# Altium project Alife7-genx320-version-ctrl-rev3.PrjPcb
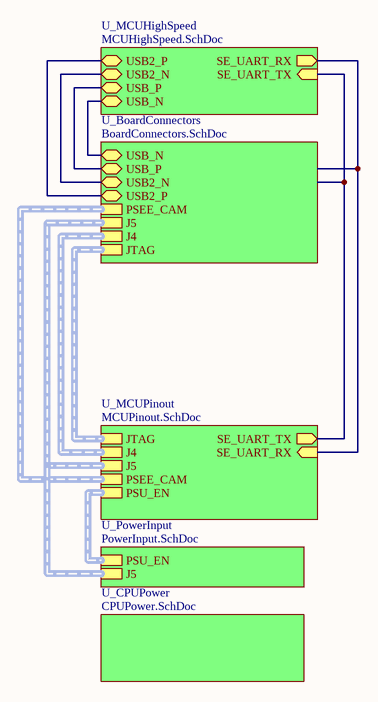
[diagram p0: TopLevel.SchDoc]
CAGE_CODE: ?????; CONTRACT_NUMBER: <CONTRACT NO>; DOC_NO_ASSY_DWG: <ASSY DWG NO>; DOC_NO_BOM: <BOM DOC NO>; DOC_NO_FAB_DWG: <FAB DWG NO>; DOC_NO_SCH_DWG: <SCH DWG NO>; PCB_2_DEC_TOL: +/-.01; PCB_3_DEC_TOL: +/-.010; PCB_ANG_TOL: +/-1/2; PCB_ASSEMBLY_NO: <PCB ASSY NO>; PCB_CHECKER: - -----; PCB_CHECKER_APP_DATE: --/--/----; PCB_DESIGNER: - -----; PCB_DESIGNER_APP_DATE: --/--/----; PCB_DWG_NO: <PCB DWG NO>; PCB_ENGINEER: - -----; PCB_ENGINEER_APP_DATE: --/--/----; PCB_PART_NUMBER: <PCB PN>; PCB_REV: A; SCH_REV: A
6 sheets, 115 parts. Net scope: hierarchical (ports join the sheet entries above them; power ports are global).
Board file: PCB_Rev3.PcbDoc
Sheets:
  TopLevel.SchDoc
    U_CPUPower = CPUPower.SchDoc
    U_PowerInput = PowerInput.SchDoc
    U_BoardConnectors = BoardConnectors.SchDoc
    U_MCUHighSpeed = MCUHighSpeed.SchDoc
    U_MCUPinout = MCUPinout.SchDoc

## Sheet TopLevel.SchDoc
size A; SheetNumber: 1; SheetTotal: 6

### Sub-sheets
U_BoardConnectors = BoardConnectors.SchDoc: USB_N (bidir), USB_P (bidir), PSEE_CAM (harness Camera harness), J5 (harness Header J5), J4 (harness Header J4), JTAG (harness JTAG), USB2_N (bidir), USB2_P (bidir)
U_CPUPower = CPUPower.SchDoc: no entries
U_MCUHighSpeed = MCUHighSpeed.SchDoc: USB_P (bidir), USB_N (bidir), USB2_P (bidir), USB2_N (bidir), SE_UART_TX (in), SE_UART_RX (out)
U_MCUPinout = MCUPinout.SchDoc: JTAG (harness JTAG), J4 (harness Header J4), J5 (harness Header J5), SE_UART_RX (in), SE_UART_TX (out), PSEE_CAM (harness Camera harness), PSU_EN (harness Power supply enable)
U_PowerInput = PowerInput.SchDoc: PSU_EN (harness Power supply enable), J5 (harness Power supply enable)

### Nets
SEUART_RX: sheet U_MCUHighSpeed/SE_UART_RX, sheet U_MCUPinout/SE_UART_RX
SEUART_TX: sheet U_MCUHighSpeed/SE_UART_TX, sheet U_MCUPinout/SE_UART_TX
USB2_N: sheet U_BoardConnectors/USB2_N, sheet U_MCUHighSpeed/USB2_N
USB2_P: sheet U_BoardConnectors/USB2_P, sheet U_MCUHighSpeed/USB2_P
USB_N: sheet U_BoardConnectors/USB_N, sheet U_MCUHighSpeed/USB_N
USB_P: sheet U_BoardConnectors/USB_P, sheet U_MCUHighSpeed/USB_P

### Buses and harness runs
harness sheet U_BoardConnectors/J4 = sheet U_MCUPinout/J4
harness sheet U_BoardConnectors/J5 = sheet U_MCUPinout/J5 = sheet U_PowerInput/J5
harness sheet U_BoardConnectors/JTAG = sheet U_MCUPinout/JTAG
harness sheet U_BoardConnectors/PSEE_CAM = sheet U_MCUPinout/PSEE_CAM
harness sheet U_MCUPinout/PSU_EN = sheet U_PowerInput/PSU_EN

## Sheet CPUPower.SchDoc
size 393 x 279 mm; DrawnBy: Gustav Eckerbom; SheetNumber: 3; SheetTotal: 6; Project revision: Rev 1; Sheet name: CPU Power; Sheet size: A3; Project: alife7-genx320cam
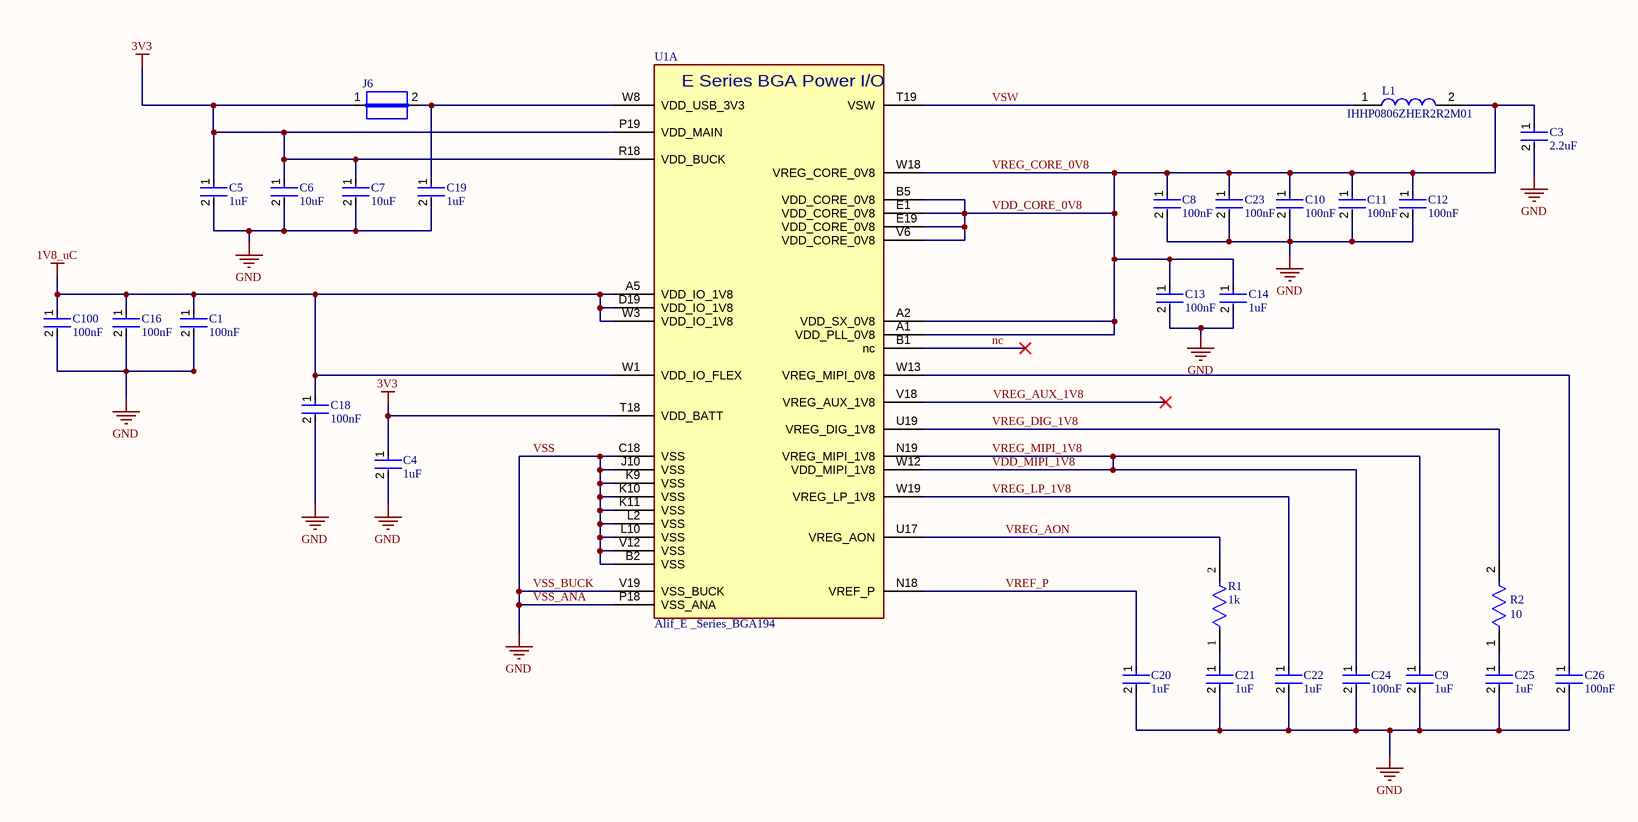
[diagram p1: CPUPower.SchDoc]

### Parts
C1  100nF  [FP-C0603X104K3RACTU-MFG]
C3  2.2uF  [FP-CC0603-DA-MFG]
C4  1uF  [FP-CL10-IPC_C]
C5  1uF  [FP-CL10-IPC_C]
C6  10uF  [FP-CC0603-0_15-0_95-IPC_C]
C7  10uF  [FP-CC0603-0_15-0_95-IPC_C]
C8  100nF  [FP-C0603X104K3RACTU-MFG]
C9  1uF  [FP-CL10-IPC_C]
C10  100nF  [FP-C0603X104K3RACTU-MFG]
C11  100nF  [FP-C0603X104K3RACTU-MFG]
C12  100nF  [FP-C0603X104K3RACTU-MFG]
C13  100nF  [FP-C0603X104K3RACTU-MFG]
C14  1uF  [FP-CL10-IPC_C]
C16  100nF  [FP-C0603X104K3RACTU-MFG]
C18  100nF  [FP-C0603X104K3RACTU-MFG]
C19  1uF  [FP-CL10-IPC_C]
C20  1uF  [FP-CL10-IPC_C]
C21  1uF  [FP-CL10-IPC_C]
C22  1uF  [FP-CL10-IPC_C]
C23  100nF  [FP-C0603X104K3RACTU-MFG]
C24  100nF  [FP-C0603X104K3RACTU-MFG]
C25  1uF  [FP-CL10-IPC_C]
C26  100nF  [FP-C0603X104K3RACTU-MFG]
C100  100nF  [FP-C0603X104K3RACTU-MFG]
J6  JUMPER  [JUMPER]  (value not drawn)
L1  IHHP0806ZHER2R2M01  [INDC2016X80N]
R1  1k  [FP-RCA0603-e3-MFG]
R2  10  [FP-RT0603-MFG]
U1  Alif_E _Series_BGA194  [BGA194 _CENTERED]  (part A of 4)

### Nets
1V8_uC: C1.1 C16.1 C18.1 C100.1 U1.A5(VDD_IO_1V8) U1.D19(VDD_IO_1V8) U1.W1(VDD_IO_FLEX) U1.W3(VDD_IO_1V8)
3V3: C4.1 C5.1 C6.1 C7.1 J6.1 U1.P19(VDD_MAIN) U1.R18(VDD_BUCK) U1.T18(VDD_BATT)
GND: C1.2 C3.2 C4.2 C5.2 C6.2 C7.2 C8.2 C9.2 C10.2 C11.2 C12.2 C13.2 C14.2 C16.2 C18.2 C19.2 C20.2 C21.2 C22.2 C23.2 C24.2 C25.2 C26.2 C100.2 U1.B2(VSS) U1.C18(VSS) U1.J10(VSS) U1.K9(VSS) U1.K10(VSS) U1.K11(VSS) U1.L2(VSS) U1.L10(VSS) U1.P18(VSS_ANA) U1.V12(VSS) U1.V19(VSS_BUCK)  [also labelled VSS, VSS_ANA, VSS_BUCK]
nc: U1.B1(nc)
VDD_CORE_0V8: C3.1 C8.1 C10.1 C11.1 C12.1 C13.1 C14.1 C23.1 L1.2 U1.A1(VDD_PLL_0V8) U1.A2(VDD_SX_0V8) U1.B5(VDD_CORE_0V8) U1.E1(VDD_CORE_0V8) U1.E19(VDD_CORE_0V8) U1.V6(VDD_CORE_0V8) U1.W18(VREG_CORE_0V8)  [also labelled VREG_CORE_0V8]
VDD_MIPI_1V8: C9.1 C24.1 U1.N19(VREG_MIPI_1V8) U1.W12(VDD_MIPI_1V8)  [also labelled VREG_MIPI_1V8]
VREF_P: C20.1 U1.N18(VREF_P)
VREG_AON: R1.2 U1.U17(VREG_AON)
VREG_AUX_1V8: U1.V18(VREG_AUX_1V8)
VREG_DIG_1V8: R2.2 U1.U19(VREG_DIG_1V8)
VREG_LP_1V8: C22.1 U1.W19(VREG_LP_1V8)
VSW: L1.1 U1.T19(VSW)
NetC19_1: C19.1 J6.2 U1.W8(VDD_USB_3V3)
NetC21_1: C21.1 R1.1
NetC25_1: C25.1 R2.1
NetC26_1: C26.1 U1.W13(VREG_MIPI_0V8)

### Notes on the sheet
- Project:
- Sheet Name
- Project revision:
- Drawn by:
- Sheet size
- SHEET
- OF
- (in symbol E7_B0_194BGA, part A) E Series BGA Power I/O

### Library data of the parts
C1 C8 C10-C13 C16 C18 C23 C24 C26 C100 = CMP-2006-00002-2: CAP CER 0.1UF 25V X7R 0603; Dielectric Material: Ceramic; Tolerance: 10%; Dissipation Factor: 3.5%; Features: Soft Termination; Construction: Flat; Number of Pins: 2; Depth: 0.8mm; Case Code (Metric): 1608; Termination: SMD/SMT; REACH SVHC: No SVHC; Dielectric: X7R; Thickness: 0.034inch; Series: C0603X; Case Code (Imperial): 0603; Voltage: 25V; Radiation Hardening: No; Length: 1.6mm; RoHS Compliant: Yes; Case/Package: 0603; Voltage Rating (DC): 25V; Max Operating Temperature: 125°C; Package Quantity: 1; Packaging: Tape and Reel; Width: 0.8mm; Height: 0.8mm; Capacitance: 100nF; Mount: Surface Mount; Voltage Rating: 25V; Contact Plating: Tin; Min Operating Temperature: -55°C
C3 = CMP-03422-000262-1: CAP CER 2.2UF 6.3V X5R 0603; Manufacturer: YAGEO; Manufacturer Part Number: CC0603KRX5R5BB225; Tolerance: 0.1; Temperature Coefficient: 15%; Material: Ceramic; Automotive: No; Temperature: -55°C to +125°C; Device Class L3: Ceramic Capacitors; Voltage Rating: 6.3 V; Device Class L1: Passive Components; Height: 0.9mm; Device Class L2: Capacitors; Temperature Range High: +125°C; Temperature Range Low: -55°C; Footprint Url: http://www.yageo.com/exep/pages/download/literatures/UPY-C_GEN_24.pdf; RoHS: TRUE; Voltage: 6.3 V; Digikey Description: CAP CER 2.2UF 6.3V X5R 0603; Package: CC0603-DA; ComponentLink2Description: Datasheet; Category: Cap; Temperature Characteristic: X5R; Capacitance: 2.2 uF; Value: 2.2 uF; Lead Free: Yes; ComponentLink2URL: http://www.yageo.com/documents/recent/UPY-GPHC_X7R_6.3V-to-50V_18.pdf; Octopart: https://octopart.com/cc0603krx5r5bb225-yageo-42244630; Mouser Description: Multilayer Ceramic Capacitors MLCC - SMD/SMT 2.2uF 6.3V X5R 10%
C4 C5 C9 C14 C19-C22 C25 = CMP-001-00087-5: Ceramic Capacitor, Multilayer, Ceramic, 10V, 10% +Tol, 10% -Tol, X5R, 15% TC, 1uF, Surface Mount, 0603; Value: 1µF; Min Operating Temperature: -55°C; Max Operating Temperature: 85°C; Case/Package: 0603; Capacitor Type: Ceramic; Mounting Technology: Surface Mount; Pins: 2; RoHS Compliant: Yes
C6 C7 = CMP-001-00088-4: Ceramic Capacitor, Multilayer, Ceramic, 6.3V, 10% +Tol, 10% -Tol, X5R, 15% TC, 10uF, Surface Mount, 0603; Value: 10µF; Min Operating Temperature: -55°C; Max Operating Temperature: 85°C; Case/Package: 0603; RoHS Compliant: Yes; Capacitor Type: Ceramic; Mounting Technology: Surface Mount; Pins: 2
J6 = CMP-009-00061-2: Pins: 2
L1 = IHHP0806ZHER2R2M01: Inductor; Manufacturer_Name: Vishay; Datasheet Link: https://www.vishay.com/docs/34591/ihhp-0806zh-01.pdf; Height: 0.8mm; Manufacturer_Part_Number: IHHP0806ZHER2R2M01; Mouser Part Number: 70-IHHP0806ZHR2R2M01; Mouser Price/Stock: https://www.mouser.co.uk/ProductDetail/Vishay-Dale/IHHP0806ZHER2R2M01?qs=tlsG%2FOw5FFirx3sf52FHuA%3D%3D
R1 = CMP-00030-22249381-1: RCA06031K00FKEA SMD Chip Resistor, 1 kOhm, ± 1%, 100 mW, 0603 [1608 Metric], Thick Film, Anti-Sulfur; Max Power Dissipation: 100mW; Temperature Coefficient: 100ppm/°C; Voltage Rating (DC): 75V; Resistance: 1kΩ; Number of Terminations: 2; Packaging: Cut Tape; Features: Anti-Sulfur, Automotive AEC-Q200; RoHS: Compliant; Power Rating: 100mW; Composition: Thick Film; Radiation Hardening: No; Voltage Rating: 75V; REACH SVHC: No SVHC; Schedule B: 8533210045; Depth: 850µm; Military Standard: Not; Case Code (Metric): 1608; Contact Plating: Tin; Tolerance: 1%; NexarPartId: 22249381; Max Operating Temperature: 155°C; Mount: Surface Mount; Length: 1.55mm; Case Code (Imperial): 0603; Width: 838.2µm; Min Operating Temperature: -55°C; Case/Package: 0603; Height: 508µm
R2 = CMP-03412-033408-1: RES SMD 10 OHM 1% 1/10W 0603; Manufacturer Part Number: RT0603FRE0710RL; Manufacturer: Yageo; Voltage Rating: 75V; Power Rating: 0.1W; Temperature Coefficient: 50 ppm/°C; Resistance: 10Ω; Tolerance: 0.01; Value: 10Ω; Footprint Url: http://www.yageo.com/exep/pages/download/literatures/PYu-R_Mount_10.pdf; Ipc Land Pattern Name: RESC16080X45; RoHS: TRUE; Device Class L2: Resistors; Device Class L3: Chip SMD Resistors; Category: Res; Device Class L1: Passive Components; ComponentLink2URL: http://www.yageo.com/documents/recent/PYu-RT_1-to-0.01_RoHS_L_9.pdf; Temperature Range Low: -55°C; Height: 0.55mm; Digikey Description: RES SMD 10 OHM 1% 1/10W 0603; Temperature Range High: +155°C; Lead Free: Yes; Composition: Thin Film; Mouser Description: Thin Film Resistors - SMD 1/10W 10 ohm 1% 50ppm; Automotive: No; Package: RT0603; Temperature: -55°C to +155°C; Series: RT; ComponentLink2Description: Datasheet; Octopart: https://octopart.com/rt0603fre0710rl-yageo-39827693
U1 = E7_B0_194BGA: IC,Alif E7 MCU, Rev B silicon,BGA194; Manufacturer 1: Alif Semi; Manufacturer Part Number 1: AE722F80F55D5LS

## Sheet PowerInput.SchDoc
size 393 x 279 mm; DrawnBy: Gustav Eckerbom; SheetNumber: 6; SheetTotal: 6; Project: alife7-genx320cam; Sheet Name: PowerInput; Sheet Size: A3; Project revision: Rev 1
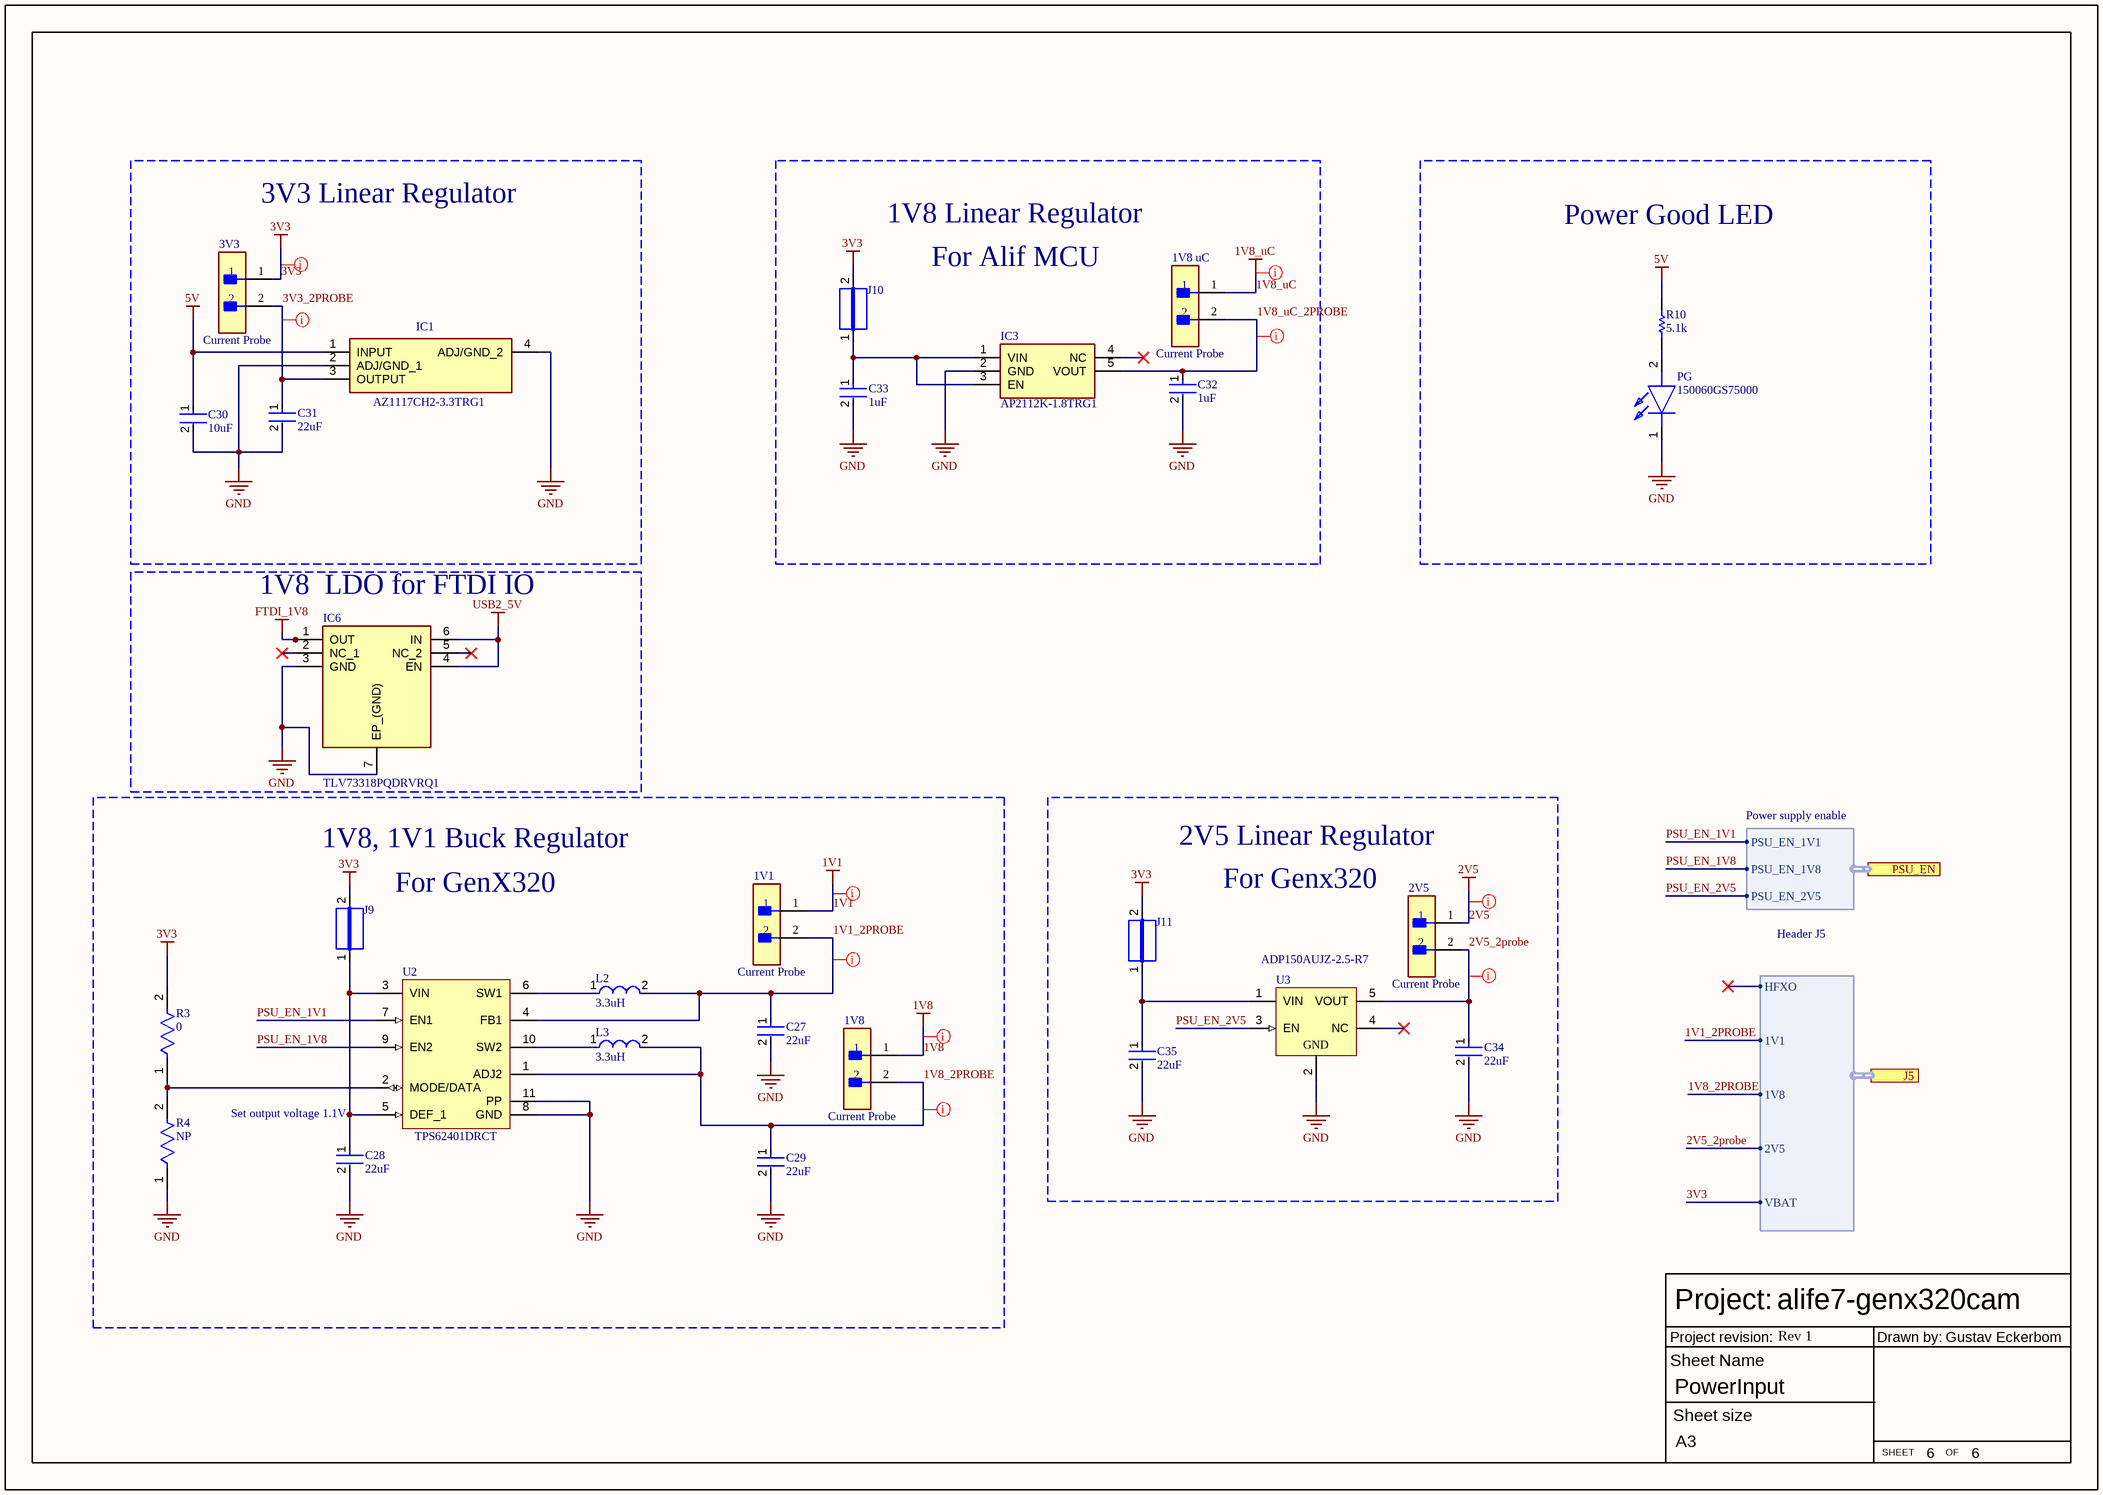
[diagram p2: PowerInput.SchDoc]

### Parts
1V1  Current Probe  [FP-4-103185-0-02-MFG]
1V8  Current Probe  [FP-4-103185-0-02-MFG]
1V8_uC  Current Probe  [FP-4-103185-0-02-MFG]
2V5  Current Probe  [FP-4-103185-0-02-MFG]
3V3  Current Probe  [FP-4-103185-0-02-MFG]
C27  22uF  [FP-1206-L_3_2_0_2-W_1_6_0-IPC_C]
C28  22uF  [FP-1206-L_3_2_0_2-W_1_6_0-IPC_C]
C29  22uF  [FP-1206-L_3_2_0_2-W_1_6_0-IPC_C]
C30  10uF  [FP-CC0603-0_15-0_95-IPC_C]
C31  22uF  [FP-1206-L_3_2_0_2-W_1_6_0-IPC_C]
C32  1uF  [FP-CL10-IPC_C]
C33  1uF  [FP-CL10-IPC_C]
C34  22uF  [FP-1206-L_3_2_0_2-W_1_6_0-IPC_C]
C35  22uF  [FP-1206-L_3_2_0_2-W_1_6_0-IPC_C]
IC1  AZ1117CH2-3.3TRG1  [SOT230P700X180-4N]
IC3  AP2112K-1.8TRG1  [SOT95P285X140-5N]
IC6  TLV73318PQDRVRQ1  [SON65P200X200X80-7N]
J9  JUMPER  [JUMPER]  (value not drawn)
J10  JUMPER  [JUMPER]  (value not drawn)
J11  JUMPER  [JUMPER]  (value not drawn)
L2  3.3uH  [FP-LQM21PH_G0-IPC_C]
L3  3.3uH  [FP-LQM21PH_G0-IPC_C]
PG  150060GS75000  [LEDC1608X80N]
R3  0  [FP-RK73Z2A-MFG]
R4  NP  [FP-RK73Z2A-MFG]
R10  5.1k  [RESC0603(1608)_N]
U2  TPS62401DRCT  [DRC0010J_V]
U3  ADP150AUJZ-2.5-R7  [ADI-UJ-5_N]

### Blocks framed on the sheet
3V3 Linear Regulator: 3V3 C30 C31 IC1
Power Good LED: PG R10
1V8  LDO for FTDI IO: IC6

### Ports
J5 (harness Header J5), PSU_EN (harness Power supply enable)

### Harnesses
Power supply enable: PSU_EN_1V1, PSU_EN_1V8, PSU_EN_2V5
Header J5: HFXO, 1V1, 2V5, 1V8, VBAT

### Nets
1V1: 1V1.1
1V8: 1V8.1
1V8_uC: 1V8_uC.1
2V5: 2V5.1
3V3: 3V3.1 J9.2 J10.2 J11.2 R3.2 ; port J5.VBAT
5V: C30.1 IC1.1(INPUT) R10.2
FTDI_1V8: IC6.1(OUT)  [project net FTVIO]
GND: C27.2 C28.2 C29.2 C30.2 C31.2 C32.2 C33.2 C34.2 C35.2 IC1.2(ADJ/GND_1) IC1.4(ADJ/GND_2) IC3.2(GND) IC6.3(GND) IC6.7(EP_(GND)) PG.1(K) R4.1 U2.8(GND) U2.11(PP) U3.2(GND)
USB2_5V: IC6.4(EN) IC6.6(IN)
1V1_2PROBE: 1V1.2 C27.1 L2.2 U2.4(FB1) ; port J5.1V1
1V8_2PROBE: 1V8.2 C29.1 L3.2 U2.1(ADJ2) ; port J5.1V8
1V8_uC_2PROBE: 1V8_uC.2 C32.1 IC3.5(VOUT)
2V5_2probe: 2V5.2 C34.1 U3.5(VOUT) ; port J5.2V5
3V3_2PROBE: 3V3.2 C31.1 IC1.3(OUTPUT)
PSU_EN_1V1: U2.7(EN1) ; port PSU_EN.PSU_EN_1V1
PSU_EN_1V8: U2.9(EN2) ; port PSU_EN.PSU_EN_1V8
PSU_EN_2V5: U3.3(EN) ; port PSU_EN.PSU_EN_2V5
NetC28_1: C28.1 J9.1 U2.3(VIN) U2.5(DEF_1)
NetC33_1: C33.1 IC3.1(VIN) IC3.3(EN) J10.1
NetC35_1: C35.1 J11.1 U3.1(VIN)
NetL2_1: L2.1 U2.6(SW1)
NetL3_1: L3.1 U2.10(SW2)
NetPG_2: PG.2(A) R10.1
NetR3_1: R3.1 R4.2 U2.2(MODE/DATA)

Not connected (* = marked no-connect by the designer): IC3 4(NC)*; IC6 2(NC_1)* 5(NC_2)*; U3 4(NC)*

### Layout directives
net class Power: 1V1, 1V1_2PROBE, 1V8, 1V8_2PROBE, 1V8_uC, 1V8_uC_2PROBE, 2V5, 2V5_2probe, 3V3, 3V3_2PROBE

### Notes on the sheet
- 1V8 Linear Regulator
- For Alif MCU
- 1V8, 1V1 Buck Regulator
- (near J9) For GenX320
- 2V5 Linear Regulator
- For Genx320
- Set output voltage 1.1V
- Project:
- Sheet Name
- Project revision:
- Drawn by:
- Sheet size
- SHEET
- OF

### Library data of the parts
1V1 1V8 1V8_uC 2V5 3V3 = CMP-06573-39509931-1: 4-103185-0-02 Conn Header Vert 2POS 2.54MM; Connector Type: Male Pin; Number of Contacts: 2; Gender: Male; Width: 2.34mm; Contact Plating: Gold; Number of Rows: 1; Pitch: 2.54mm; Termination: Solder; Housing Color: Black; Mount: Through Hole; Contact Mating Length: 5.842mm; Housing Material: Plastic; Length: 4.67mm; Number of Positions: 2; Packaging: Bulk; NexarPartId: 39509931; Contact Material: Bronze; Lead Free: Contains Lead; Case/Package: 100; Color: Black; RoHS: Non-Compliant; Height: 2.29mm
C27-C29 C31 C34 C35 = CMP-001-00089-1: Ceramic Capacitor, Multilayer, Ceramic, 6.3V, 20% +Tol, 20% -Tol, X7R, 15% TC, 22uF, Surface Mount, 1206; Value: 22µF; Min Operating Temperature: -55°C; Case/Package: 1206; Max Operating Temperature: 125°C; Capacitor Type: Ceramic; Mounting Technology: Surface Mount; Pins: 2; RoHS Compliant: Yes
C30 = CMP-001-00088-4: as C6 on sheet CPUPower; Min Operating Temperature: -55°C; Max Operating Temperature: 85°C; Case/Package: 0603; RoHS Compliant: Yes; Capacitor Type: Ceramic; Mounting Technology: Surface Mount; Pins: 2
C32 C33 = CMP-001-00087-5: as C4 on sheet CPUPower; Min Operating Temperature: -55°C; Max Operating Temperature: 85°C; Case/Package: 0603; Capacitor Type: Ceramic; Mounting Technology: Surface Mount; Pins: 2; RoHS Compliant: Yes
IC1 = AZ1117CH2-3.3TRG1: Integrated Circuit; Manufacturer_Name: Diodes Incorporated; Datasheet Link: https://www.diodes.com//assets/Datasheets/AZ1117C.pdf; Height: 1.8mm; Manufacturer_Part_Number: AZ1117CH2-3.3TRG1; Mouser Part Number: 621-AZ1117CH2-33TRG1; Mouser Price/Stock: https://www.mouser.co.uk/ProductDetail/Diodes-Incorporated/AZ1117CH2-3.3TRG1?qs=lQAVKuKFhkLc7jCxso2G3w%3D%3D; Arrow Part Number: AZ1117CH2-3.3TRG1; Arrow Price/Stock: https://www.arrow.com/en/products/az1117ch2-3.3trg1/diodes-incorporated?utm_currency=USD&region=nac
IC3 = AP2112K-1.8TRG1: Integrated Circuit; Manufacturer_Name: Diodes Incorporated; Datasheet Link: https://www.diodes.com//assets/Datasheets/AP2112.pdf; Height: 1.4mm; Manufacturer_Part_Number: AP2112K-1.8TRG1; Mouser Part Number: 621-AP2112K-1.8TRG1; Mouser Price/Stock: https://www.mouser.co.uk/ProductDetail/Diodes-Incorporated/AP2112K-1.8TRG1?qs=x6A8l6qLYDBx1xhw8AX2cw%3D%3D; Arrow Part Number: AP2112K-1.8TRG1; Arrow Price/Stock: https://www.arrow.com/en/products/ap2112k-1.8trg1/diodes-incorporated?region=nac
IC6 = TLV73318PQDRVRQ1: Integrated Circuit; Manufacturer_Name: Texas Instruments; Datasheet Link: http://www.ti.com/lit/gpn/tlv733p-q1; Height: 0.8mm; Manufacturer_Part_Number: TLV73318PQDRVRQ1; Mouser Part Number: 595-TLV73318PQDRVRQ1; Mouser Price/Stock: https://www.mouser.co.uk/ProductDetail/Texas-Instruments/TLV73318PQDRVRQ1?qs=Euq2YPj5ArJy%2FbA%2Fxu1pyg%3D%3D; Arrow Part Number: TLV73318PQDRVRQ1; Arrow Price/Stock: https://www.arrow.com/en/products/tlv73318pqdrvrq1/texas-instruments
J9-J11 = CMP-009-00061-2: Pins: 2
L2 L3 = CMP-06042-016226-1: Multilayer Type Inductor for Power Lines, 0805 (2012), 3.3μH, 30%, 0.207Ω, 0.8A; Max DC Current: 800mA; Test Frequency: 1MHz; Shielding: Shielded; Core Material: Ferrite; DC Resistance (DCR): 207mR; Self Resonant Frequency: 30MHz; Length: 0.079inch; Series: LQM21PN_G0; Width: 1.25mm; Termination: SMD/SMT; Tolerance: 30%; Case Code (Imperial): 0805; Min Operating Temperature: -55°C; Inductance: 3.3uH; Current Rating: 800mA; Mount: Surface Mount; Packaging: Tape and Reel; RoHS Compliant: Yes; Height - Seated (Max): 0.039inch; Package Quantity: 4000; Case/Package: 0805; Height: 0.9mm; Max Operating Temperature: 125°C; Case Code (Metric): 2012
PG = 150060GS75000: LED; Manufacturer_Name: Wurth Elektronik; Datasheet Link: https://componentsearchengine.com/Datasheets/2/150060GS75000.pdf; Height: 0.8mm; Manufacturer_Part_Number: 150060GS75000; Mouser Part Number: 710-150060GS75000; Mouser Price/Stock: https://www.mouser.co.uk/ProductDetail/Wurth-Elektronik/150060GS75000?qs=LlUlMxKIyB0UYkq5lDO8nA%3D%3D
R3 R4 = CMP-2000-05462-2: RES 0 OHM JUMPER 0805; Temperature Coefficient: 400ppm/°C; Tolerance: 1%; Resistance: 0mR; Power Rating: 2W; Min Operating Temperature: -55°C; Termination: SMD/SMT; Width: 1.25mm; Series: RK73Z; Lead Free: Lead Free; Case Code (Metric): 2012; Military Standard: Not; Case Code (Imperial): 0805; Packaging: Tape and Reel; Max Operating Temperature: 155°C; Package Quantity: 5000; Height: 0.5mm; RoHS Compliant: Yes; Depth: 1.25mm; Length: 2mm; Resistor Type: Thick Film; Case/Package: 0805; Construction: Rectangular
R10 = CMP-1012-00081-1: 2K 0.1W 5% 0603 (1608 Metric)  SMD; Case-Metric: 1608; Value: 2000.00 Ohm; Case-EIA: 0603; Tolerance: 5 %; Technology: SMT; Power: 0.1 W
U2 = CMP-0323-00299-3: Buck Step Down Regulator with 2.5 to 6 V Input and 1.1 to 1.575 V Output, -40 to 85 degC, 10-Pin SON (DRC), Green (RoHS & no Sb/Br); Manufacturer: Texas Instruments; Vin(Max)(V): 6; Synchronous Rectification: TRUE; Regulated Outputs(#): 2; Iout(Max)(A): 0.4; Duty Cycle(Max)(%): 100; Vout2(Min)(V): 2.8; SubFamily: Step-Down Regulator; Vout(Min)(V): 1.1; Vin(Min)(V): 2.5; Iout2(Max)(A): 0.6; Switch Current Limit(Typ)(A): 1; Rating: Catalog; Iq(Typ)(mA): 0.032; Vout(Max)(V): 1.575; Eco-Plan: Green (RoHS & no Sb/Br); ComponentLink3URL: Samples URL:http://www.ti.com/product/tps62401#samples; Topology: Buck; Vout2(Max)(V): 2.8; ComponentLink1URL: http://www.ti.com/general/docs/lit/getliterature.tsp?genericPartNumber=TPS62401&fileType=pdf; ComponentLink1Description: Datasheet; Dynamic Voltage Scaling: TRUE; ComponentLink2Description: Package Specification; PackageVersion: revL, Sep-2011; ComponentLink3Description: URL Link1; Mounting Technology: Surface Mount; ComponentLink2URL: http://www.ti.com/litv/pdf/mpds117k; PartNumber: TPS62401DRCT; PackageDescription: 10-Pin Plastic Small Outline No-Lead, 3 x 3 x 1 mm Body, 0.5 mm Pitch, Exposed Pad; PackageReference: DRC0010J; DatasheetVersion: SLVS681E
U3 = CMP-0786-00375-1: Ultralow Noise, 150 mA CMOS Linear Regulator, 2.2 to 5.5 V Vin, 2.5 V Vout, Industrial, 5-pin SOT23 (UJ-5), Reel; Manufacturer: Analog Devices; Iout max: 150mA; Preset Vout Values (V): 2.5; Supply Current IGND @ Small Load: 10uA; Vin (max) (V): 5.5; Vin (min) (V): 2.2; ComponentLink1URL: http://www.analog.com/en/index.html; ComponentLink2Description: Datasheet; ComponentLink4URL: Product URL:http://www.analog.com/en/ADP150/productSearch.html; ComponentLink3Description: Package Specification; PackageDescription: 5-Pin Thin Small Outline Transistor Package, Body 2.9 x 1.6 mm, Pitch 0.95 mm; PackageReference: UJ-5; ComponentLink3URL: http:/www.analog.com/static/imported-files/packages/PKG_PDF/TSOT(UJ)/UJ_5.pdf; Packing: Reel; ComponentLink4Description: URL Link1; ComponentLink2URL: http://www.analog.com/static/imported-files/data_sheets/ADP150.pdf; Code_JEDEC: MO-193-AB; DatasheetVersion: Rev. A; PackageVersion: 100708-A, 10/2008; ComponentLink1Description: Manufacturer URL; Mounting Technology: Surface Mount; PartNumber: ADP150AUJZ-2.5-R7

## Sheet BoardConnectors.SchDoc
size 393 x 279 mm; DrawnBy: Gustav Eckerbom; SheetNumber: 2; SheetTotal: 6; Project: alife7-genx320cam; Project revision: Rev 1; Sheet Name: BoardConnectors; Sheet size: A3
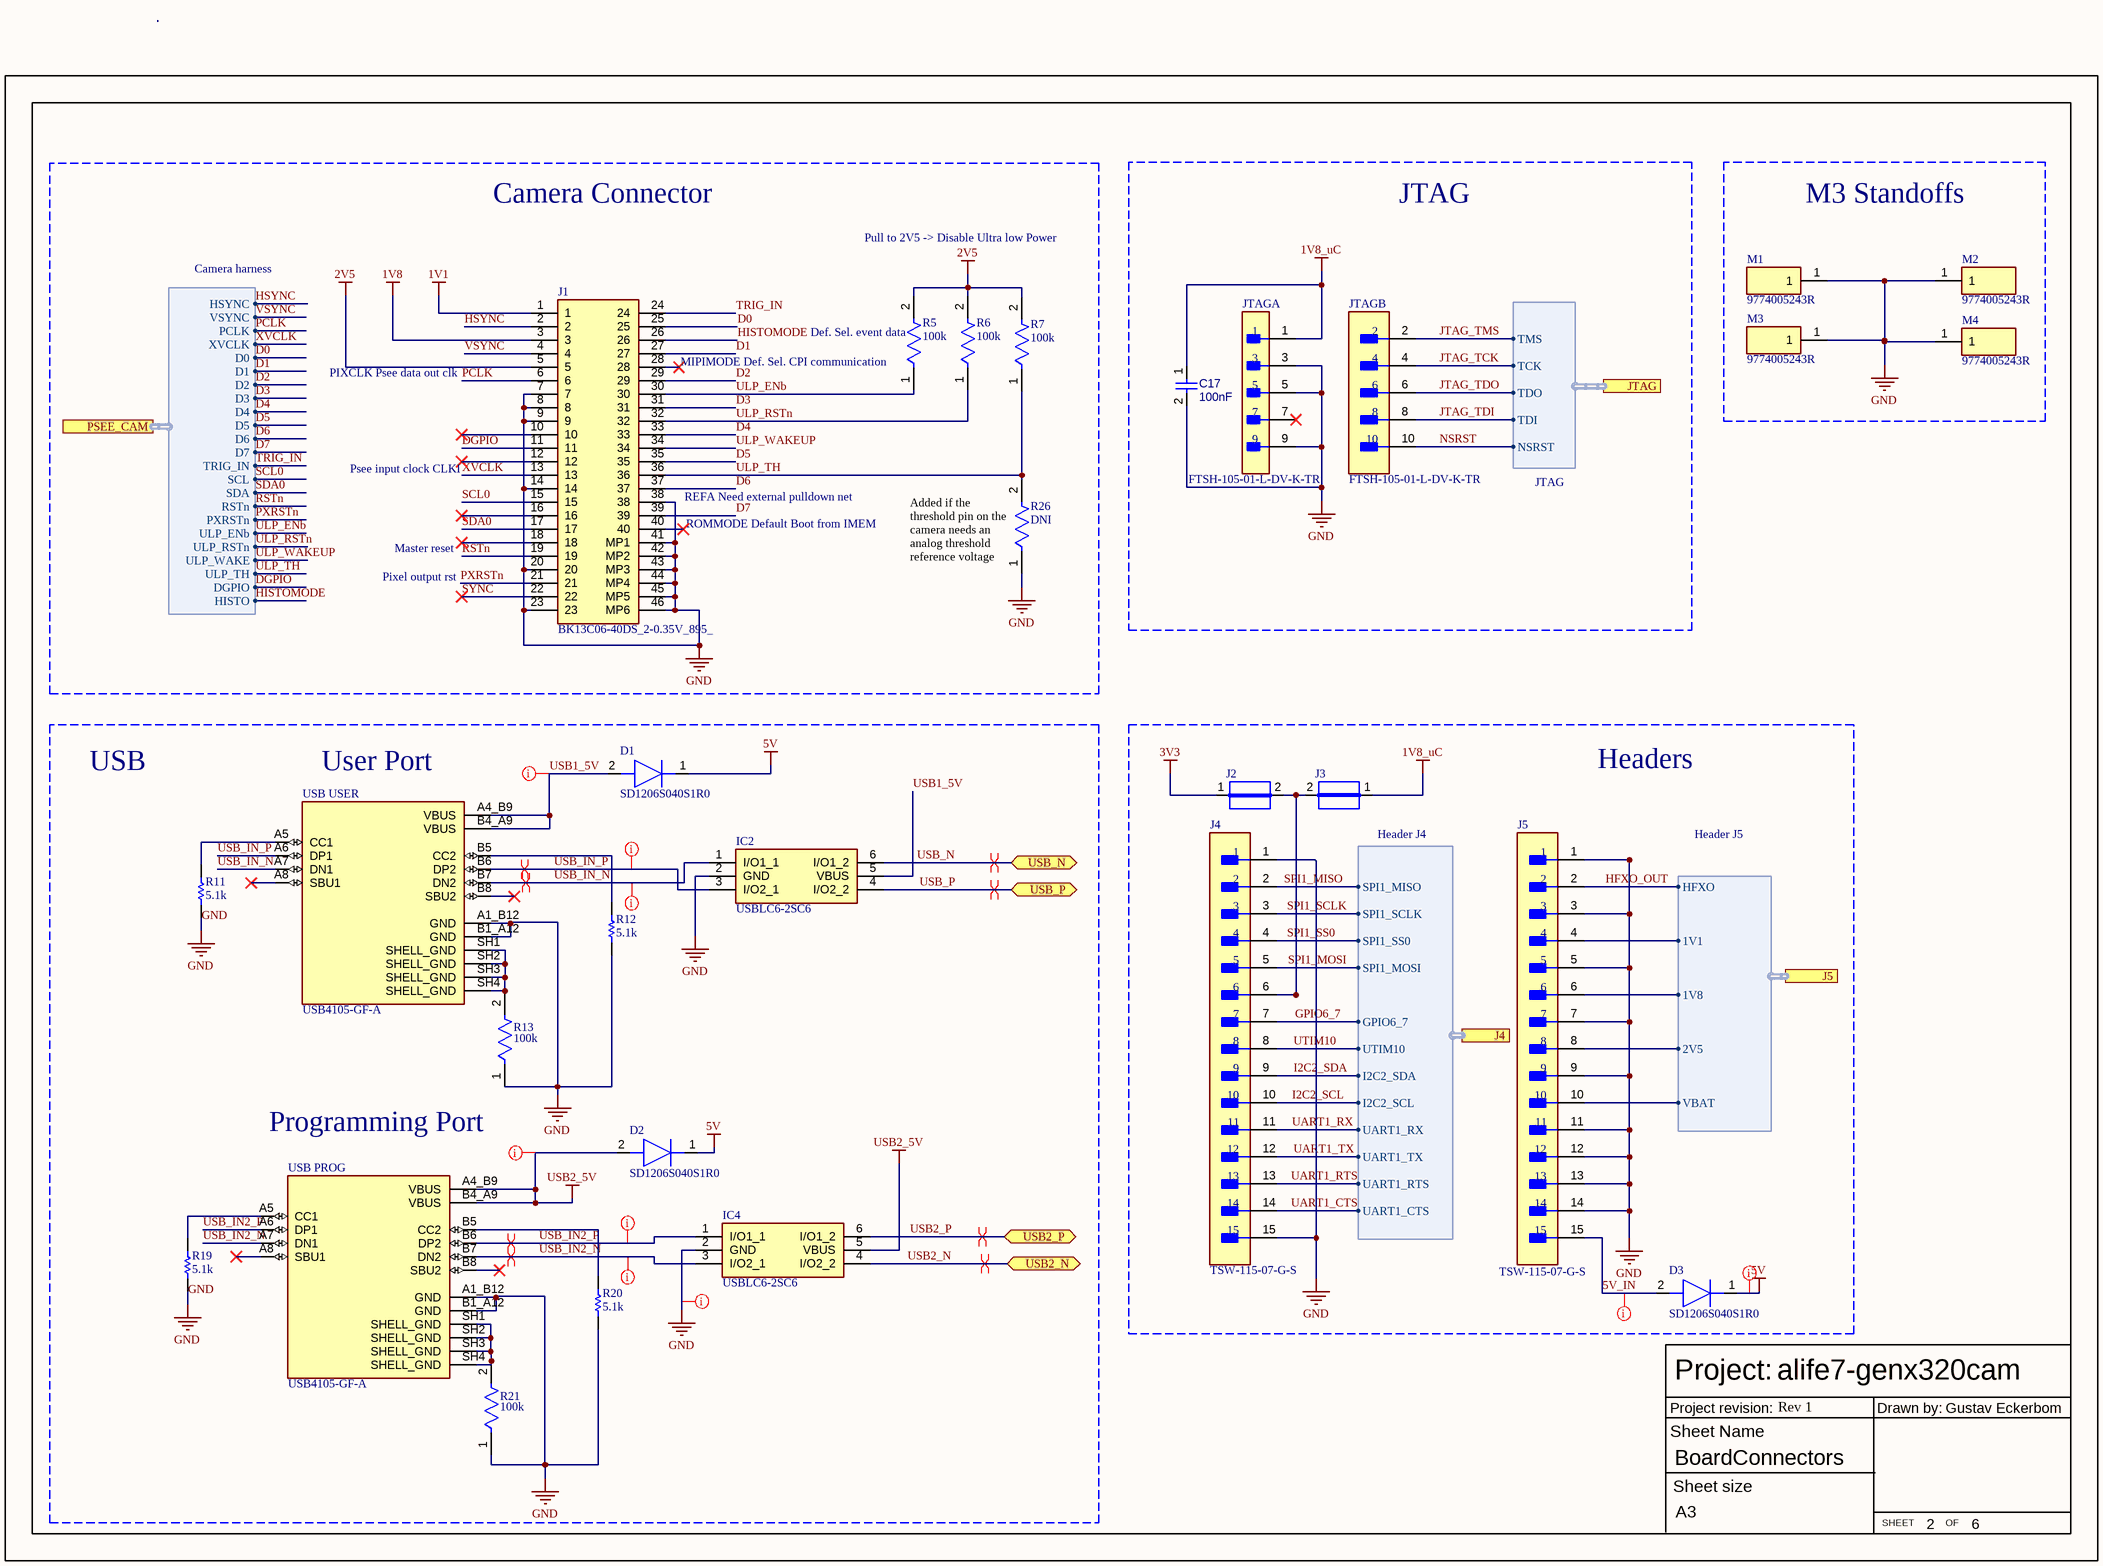
[diagram p3: BoardConnectors.SchDoc]

### Parts
C17  100nF  [FP-C0603X104K3RACTU-IPC_C]
D1  SD1206S040S1R0  [DIOC3419X116N]
D2  SD1206S040S1R0  [DIOC3419X116N]
D3  SD1206S040S1R0  [DIOC3419X116N]
IC2  USBLC6-2SC6  [SOT95P280X145-6N]
IC4  USBLC6-2SC6  [SOT95P280X145-6N]
J1  BK13C06-40DS_2-0.35V_895_  [BK13C0640DS2035V895]
J2  JUMPER  [JUMPER]  (value not drawn)
J3  JUMPER  [JUMPER]  (value not drawn)
J4  TSW-115-07-G-S  [FP-TSW-115-07-G-S-MFG]
J5  TSW-115-07-G-S  [FP-TSW-115-07-G-S-MFG]
JTAG  FTSH-105-01-L-DV-K-TR  [FP-FTSH-105-01-L-DV-K-TR-MFG]  (parts A,B of 2)
M1  9774005243R  [9774005243R]
M2  9774005243R  [9774005243R]
M3  9774005243R  [9774005243R]
M4  9774005243R  [9774005243R]
R5  100k  [FP-RC0603-0_55-IPC_B]
R6  100k  [FP-RC0603-0_55-IPC_B]
R7  100k  [FP-RC0603-0_55-IPC_B]
R11  5.1k  [RESC1608X55X30LL15T15]
R12  5.1k  [RESC1608X55X30LL15T15]
R13  100k  [FP-RC0603-0_55-IPC_C]
R19  5.1k  [RESC1608X55X30LL15T15]
R20  5.1k  [RESC1608X55X30LL15T15]
R21  100k  [FP-RC0603-0_55-IPC_B]
R26  DNI  [FP-RC0603-0_55-IPC_B]
USB_PROG  USB4105-GF-A  [GCT_USB4105-GF-A]
USB_USER  USB4105-GF-A  [GCT_USB4105-GF-A]

### Blocks framed on the sheet
Camera Connector: J1 R5-R7 R26
JTAG: C17 JTAG
M3 Standoffs: M1-M4
Headers: D3 J2-J5

### Ports
J4 (harness Header J4), J5 (harness Header J5), JTAG (harness JTAG), PSEE_CAM (harness Camera harness), USB2_N (bidir), USB2_P (bidir), USB_N (bidir), USB_P (bidir)

### Harnesses
JTAG: TMS, TCK, TDO, TDI, NSRST
Camera harness: HSYNC, VSYNC, PCLK, XVCLK, D0, D1, D2, D3, D4, D5, D6, D7, SCL, SDA, RSTn, PXRSTn, ULP_ENb, ULP_RSTn, ULP_WAKE, ULP_TH, DGPIO, HISTO, TRIG_IN
Header J5: HFXO, 1V1, 2V5, 1V8, VBAT
Header J4: SPI1_MOSI, GPIO6_7, UTIM10, I2C2_SDA, UART1_TX, UART1_RX, I2C2_SCL, SPI1_SS0, SPI1_MISO, SPI1_SCLK, UART1_RTS, UART1_CTS

### Nets
1V1: J1.1
1V8: J1.3
1V8_uC: C17.1 J3.1 JTAG.1
2V5: J1.5 R5.2 R6.2 R7.2
3V3: J2.1 J5.10 ; port J5.VBAT
5V: D1.1(K) D2.1(K) D3.1(K)
GND: C17.2 IC2.2(GND) IC4.2(GND) J1.7 J1.8 J1.9 J1.14 J1.20 J1.23 J1.38 J1.41(MP1) J1.42(MP2) J1.43(MP3) J1.44(MP4) J1.45(MP5) J1.46(MP6) J4.1 J4.15 J5.1 J5.3 J5.5 J5.7 J5.9 J5.11 J5.12 J5.13 J5.14 JTAG.3 JTAG.5 JTAG.9 M1.1 M2.1 M3.1 M4.1 R11.1 R12.1 R13.1 R19.1 R20.1 R21.1 R26.1 USB_PROG.A1_B12(GND) USB_PROG.B1_A12(GND) USB_USER.A1_B12(GND) USB_USER.B1_A12(GND)
USB2_5V: D2.2(A) IC4.5(VBUS) USB_PROG.A4_B9(VBUS) USB_PROG.B4_A9(VBUS)
1V1_2PROBE: J5.4 ; port J5.1V1
1V8_2PROBE: J5.6 ; port J5.1V8
2V5_2probe: J5.8 ; port J5.2V5
5V_IN: D3.2(A) J5.15
D0: J1.25 ; port PSEE_CAM.D0
D1: J1.27 ; port PSEE_CAM.D1
D2: J1.29 ; port PSEE_CAM.D2
D3: J1.31 ; port PSEE_CAM.D3
D4: J1.33 ; port PSEE_CAM.D4
D5: J1.35 ; port PSEE_CAM.D5
D6: J1.37 ; port PSEE_CAM.D6
D7: J1.39 ; port PSEE_CAM.D7
DGPIO: J1.11 ; port PSEE_CAM.DGPIO
GPIO6_7: J4.7 ; port J4.GPIO6_7
HFXO_OUT: J5.2 ; port J5.HFXO
HISTOMODE: J1.26 ; port PSEE_CAM.HISTO
HSYNC: J1.2 ; port PSEE_CAM.HSYNC
I2C2_SCL: J4.10 ; port J4.I2C2_SCL
I2C2_SDA: J4.9 ; port J4.I2C2_SDA
JTAG_TCK: JTAG.4 ; port JTAG.TCK
JTAG_TDI: JTAG.8 ; port JTAG.TDI
JTAG_TDO: JTAG.6 ; port JTAG.TDO
JTAG_TMS: JTAG.2 ; port JTAG.TMS
NSRST: JTAG.10 ; port JTAG.NSRST
PCLK: J1.6 ; port PSEE_CAM.PCLK
PXRSTn: J1.21 ; port PSEE_CAM.PXRSTn
RSTn: J1.19 ; port PSEE_CAM.RSTn
SCL0: J1.15 ; port PSEE_CAM.SCL
SDA0: J1.17 ; port PSEE_CAM.SDA
SPI1_MISO: J4.2 ; port J4.SPI1_MISO
SPI1_MOSI: J4.5 ; port J4.SPI1_MOSI
SPI1_SCLK: J4.3 ; port J4.SPI1_SCLK
SPI1_SS0: J4.4 ; port J4.SPI1_SS0
SYNC: J1.22
TRIG_IN: J1.24 ; port PSEE_CAM.TRIG_IN
UART1_CTS: J4.14 ; port J4.UART1_CTS
UART1_RTS: J4.13 ; port J4.UART1_RTS
UART1_RX: J4.11 ; port J4.UART1_RX
UART1_TX: J4.12 ; port J4.UART1_TX
ULP_ENb: J1.30 R5.1 ; port PSEE_CAM.ULP_ENb
ULP_RSTn: J1.32 R6.1 ; port PSEE_CAM.ULP_RSTn
ULP_TH: J1.36 R7.1 R26.2 ; port PSEE_CAM.ULP_TH
ULP_WAKEUP: J1.34 ; port PSEE_CAM.ULP_WAKE
USB1_5V: D1.2(A) IC2.5(VBUS) USB_USER.A4_B9(VBUS) USB_USER.B4_A9(VBUS)
USB2_N: IC4.4(I/O2_2) ; port USB2_N
USB2_P: IC4.6(I/O1_2) ; port USB2_P
USB_IN2_N: IC4.3(I/O2_1) USB_PROG.A7(DN1) USB_PROG.B7(DN2)
USB_IN2_P: IC4.1(I/O1_1) USB_PROG.A6(DP1) USB_PROG.B6(DP2)
USB_IN_N: IC2.1(I/O1_1) USB_USER.A7(DN1) USB_USER.B7(DN2)
USB_IN_P: IC2.3(I/O2_1) USB_USER.A6(DP1) USB_USER.B6(DP2)
USB_N: IC2.6(I/O1_2) ; port USB_N
USB_P: IC2.4(I/O2_2) ; port USB_P
UTIM10: J4.8 ; port J4.UTIM10
VSYNC: J1.4 ; port PSEE_CAM.VSYNC
XVCLK: J1.13 ; port PSEE_CAM.XVCLK
NetJ2_2: J2.2 J3.2 J4.6
NetR11_2: R11.2 USB_USER.A5(CC1)
NetR12_2: R12.2 USB_USER.B5(CC2)
NetR13_2: R13.2 USB_USER.SH1(SHELL_GND) USB_USER.SH2(SHELL_GND) USB_USER.SH3(SHELL_GND) USB_USER.SH4(SHELL_GND)
NetR19_2: R19.2 USB_PROG.A5(CC1)
NetR20_2: R20.2 USB_PROG.B5(CC2)
NetR21_2: R21.2 USB_PROG.SH1(SHELL_GND) USB_PROG.SH2(SHELL_GND) USB_PROG.SH3(SHELL_GND) USB_PROG.SH4(SHELL_GND)

Not connected (* = marked no-connect by the designer): J1 10* 12* 16* 18* 28* 40*; JTAG 7*; USB_PROG A8(SBU1)* B8(SBU2)*; USB_USER A8(SBU1)* B8(SBU2)*

### Layout directives
differential pair: USB2_N, USB2_P, USB_IN2_N, USB_IN2_P, USB_IN_N, USB_IN_P, USB_N, USB_P
net class Power: 5V, 5V_IN, GND, USB1_5V, USB2_5V
net class Diffpair: USB_IN2_N, USB_IN2_P, USB_IN_N, USB_IN_P

### Notes on the sheet
- Pull to 2V5 -> Disable Ultra low Power
- (near R5) MIPIMODE Def. Sel. CPI communication
- (near R5) Def. Sel. event data
- PIXCLK Psee data out clk
- Psee input clock CLKI
- (near J1) REFA Need external pulldown net
- Master reset
- (near J1) ROMMODE Default Boot from IMEM
- (near R26) Added if the threshold pin on the camera needs an analog threshold reference voltage
- Pixel output rst
- USB
- (near USB_USER) User Port
- Programming Port
- Project:
- Sheet Name
- Project revision:
- Drawn by:
- Sheet size
- SHEET
- OF

### Library data of the parts
C17 = CMP-001-00090-1: Ceramic Capacitor, Multilayer, Ceramic, 25V, 10% +Tol, 10% -Tol, X7R, 15% TC, 0.1uF, Surface Mount, 0603; RoHS Compliant: Yes; Case/Package: 0603; Max Operating Temperature: 125°C; Min Operating Temperature: -55°C; Capacitor Type: Ceramic; Mounting Technology: Surface Mount; Pins: 2; Value: 100nF
D1-D3 = SD1206S040S1R0: Diode; Manufacturer_Name: Kyocera AVX; Datasheet Link: https://componentsearchengine.com/Datasheets/1/SD1206S040S1R0.pdf; Height: 1.16mm; Manufacturer_Part_Number: SD1206S040S1R0; Mouser Part Number: 581-SD1206S040S1R0; Mouser Price/Stock: https://www.mouser.co.uk/ProductDetail/KYOCERA-AVX/SD1206S040S1R0?qs=jCA%252BPfw4LHZ%2FRBugmNm8zw%3D%3D; Arrow Part Number: SD1206S040S1R0; Arrow Price/Stock: https://www.arrow.com/en/products/sd1206s040s1r0/avx
IC2 IC4 = USBLC6-2SC6: Integrated Circuit; Manufacturer_Name: STMicroelectronics; Datasheet Link: http://www.st.com/st-web-ui/static/active/en/resource/technical/document/datasheet/CD00050750.pdf; Height: 1.45mm; Manufacturer_Part_Number: USBLC6-2SC6; Mouser Part Number: 511-USBLC6-2SC6; Mouser Price/Stock: https://www.mouser.co.uk/ProductDetail/STMicroelectronics/USBLC6-2SC6?qs=po45yt2pPpu%2FhNIlwQdTlg%3D%3D; Arrow Part Number: USBLC6-2SC6; Arrow Price/Stock: https://www.arrow.com/en/products/usblc6-2sc6/stmicroelectronics?utm_currency=USD&region=europe
J1 = BK13C06-40DS_2-0.35V_895_: Connector; Manufacturer_Name: Hirose; Manufacturer_Part_Number: BK13C06-40DS/2-0.35V(895); Datasheet Link: https://www.hirose.com/en/product/document?clcode=CL0480-0666-0-95&productname=BK13C06-40DS%2f2-0.35V(895)&series=BK13C&documenttype=2DDrawing&lang=en&documentid=BK13C06-40DS2-0.35V(895)_4800666095_2D_ENG; Height: 0.65mm; Mouser Part Number: 798-BK13C0640DS35V89; Mouser Price/Stock: https://www.mouser.co.uk/ProductDetail/Hirose-Connector/BK13C06-40DS-2-0.35V895?qs=TuK3vfAjtkUd%2FKM0cID%2Fnw%3D%3D
J2 J3 = CMP-009-00061-2: Pins: 2
J4 J5 = CMP-02766-000090-1: CONN HEADER VERT 15POS 2.54MM; Manufacturer: SAMTEC; Conn Gender: Male; Number Of Contacts: 15; Conn Orientation: Vertical; Package: TSW-115-07-G-S; RoHS: TRUE; Manufacturer Part Number: TSW-115-07-G-S; Digikey Description: CONN HEADER VERT 15POS 2.54MM; Device Class L1: Connectors; Temperature Range Low: -55°C; Height: 8.71mm; Contact Material: Gold,Nickel; ComponentLink2URL: http://suddendocs.samtec.com/catalog_english/tsw_th.pdf; ComponentLink2Description: Datasheet; Category: Conn; Footprint Url: http://suddendocs.samtec.com/prints/tsw-xxx-xx-x-x-xx-xxx-footprint.pdf; Lead Free: Yes; Octopart: https://octopart.com/tsw-115-07-g-s-samtec-272210; Pitch: 2.54mm; Device Class L2: Headers and Wire Housings; Temperature: -55°C to +125°C; Number Of Rows: 1; Automotive: No; Device Class L3: unset; Temperature Range High: +125°C
JTAG = CMP-2000-06293-2: CONN HEADER SMD 10POS 1.27MM; Max Current Rating: 1.75A; Number of Contacts: 10; Gender: Male; Row Spacing: 0.05inch; Connector Type: Male Pin; Housing Color: Black; Min Operating Temperature: -55°C; Depth: 3.43mm; Color: Black; Contact Plating: Gold; REACH SVHC: No SVHC; Packaging: Tape and Reel; Current Rating: 1.75A; Radiation Hardening: No; Package Quantity: 550; Number of Positions: 10; Max Operating Temperature: 125°C; Orientation: Straight; Termination: Solder; Contact Mating Length: 0.12inch; Number of Rows: 2; Lead Free: Lead Free; Contact Material: Bronze; Mount: Surface Mount; Housing Material: Polymer; Pitch: 1.27mm; Length: 6.35mm
M1-M4 = 9774005243R: Connector; Manufacturer_Name: Wurth Elektronik; Datasheet Link: https://www.mouser.co.uk/datasheet/2/445/9774005243R-2891020.pdf; Height: 1.55mm; Manufacturer_Part_Number: 9774005243R; Mouser Part Number: 710-9774005243R; Mouser Price/Stock: https://www.mouser.co.uk/ProductDetail/Wurth-Elektronik/9774005243R?qs=iLbezkQI%252BsiIYJ%2FPXNpHjA%3D%3D
R5-R7 R13 R21 R26 = CMP-03412-037829-1: RES 100K OHM 1% 1/10W 0603; Resistance: 100kR; Voltage Rating (DC): 50V; Temperature Coefficient: 100ppm/°C; Power Rating: 100mW; Resistance Tolerance: 1%; Case Code (Metric): 1608; RoHS Compliant: Yes; Case/Package: 0603; Resistor Type: Thick Film; Length: 1.6mm; Depth: 0.8mm; Max Operating Temperature: 155°C; Tolerance: 1%; Series: RC; Contact Plating: Tin; Width: 0.8mm; Case Code (Imperial): 0603; Number of Pins: 2; Construction: Rectangular; Termination: SMD/SMT; Military Standard: Not; Voltage Rating: 50V; Height: 0.45mm; Packaging: Tape and Reel; Min Operating Temperature: -55°C
R11 R12 R19 R20 = CMP-2000-00803-1: Part Number: ERJ-3GEYJ512V; Manufacturer: Panasonic
USB_PROG USB_USER = CMP-003-000000-2: MF: {'manufacturer': u'GCT'}; Price: None; MP: USB4105-GF-A; Value: *; Design Item ID: USB4105-GF-A; Component Type: Standard; Source: USB4105-GF-A.SchLib; Pin Count: 16; Package: None; Availability: Unavailable

## Sheet MCUHighSpeed.SchDoc
size 393 x 279 mm; DrawnBy: Gustav Eckerbom; SheetNumber: 4; SheetTotal: 6; Project: alife7-genx320cam; Project revision: Rev 1; Sheet name: MCUHighSpeed; Sheet size: A3
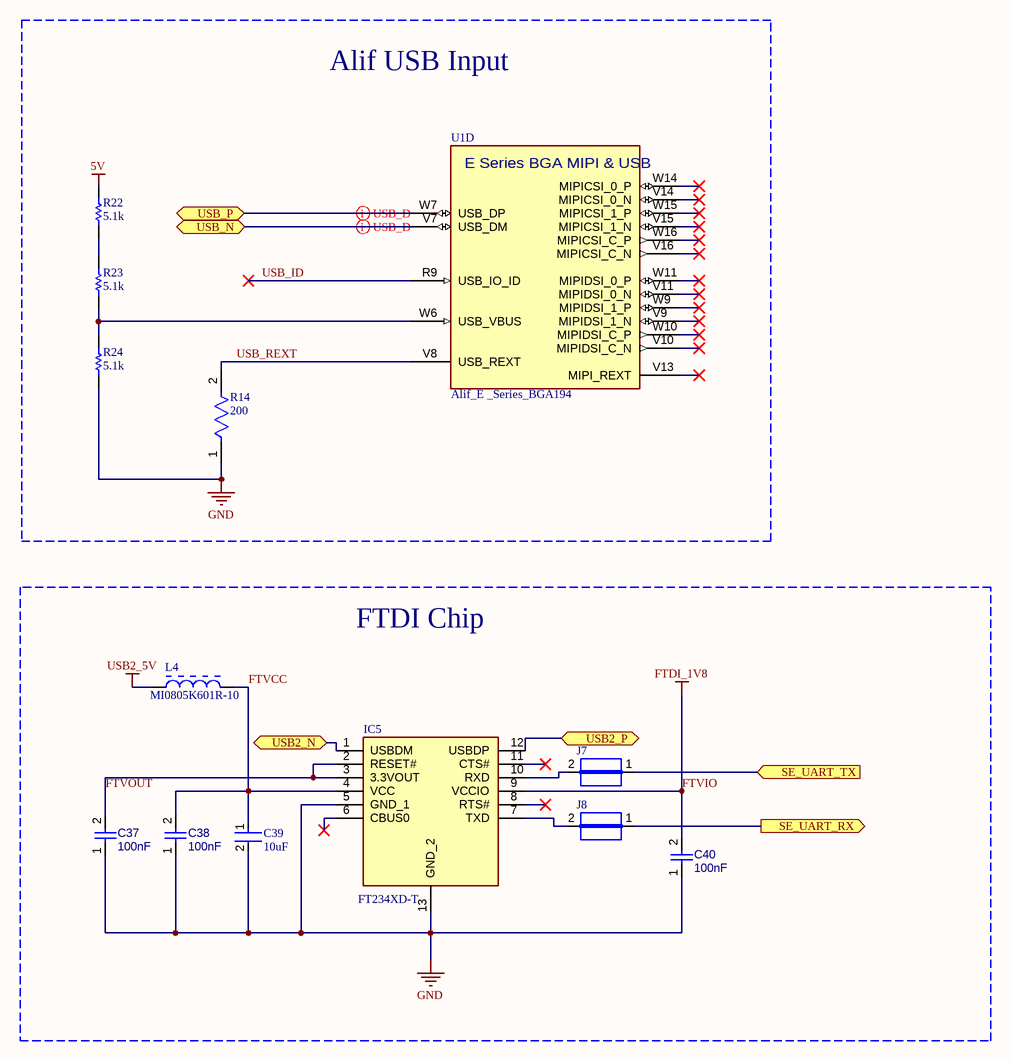
[diagram p4: MCUHighSpeed.SchDoc]

### Parts
C37  100nF  [FP-C0603X104K3RACTU-IPC_C]
C38  100nF  [FP-C0603X104K3RACTU-IPC_C]
C39  10uF  [FP-CC0603-0_15-0_95-IPC_C]
C40  100nF  [FP-C0603X104K3RACTU-IPC_C]
IC5  FT234XD-T  [SON45P300X300X80-13N-D]
J7  JUMPER  [JUMPER]  (value not drawn)
J8  JUMPER  [JUMPER]  (value not drawn)
L4  MI0805K601R-10  [LIRD-MI0805K601R-10-2_V]
R14  value 200  [FP-MCR03-IPC_C]  (hidden comment: 200R)
R22  5.1k  [RESC1608X55X30LL15T15]
R23  5.1k  [RESC1608X55X30LL15T15]
R24  5.1k  [RESC1608X55X30LL15T15]
U1  Alif_E _Series_BGA194  [BGA194 _CENTERED]  (part D of 4)

### Blocks framed on the sheet
Alif USB Input: R14 R22-R24 U1
FTDI Chip: C37-C40 IC5 J7 J8 L4

### Ports
SE_UART_RX (out), SE_UART_TX (in), USB2_N (bidir), USB2_P (bidir), USB_N (bidir), USB_P (bidir)

### Nets
5V: R22.2
FTVIO: C40.2 IC5.9(VCCIO)  [also labelled FTDI_1V8]
GND: C37.1 C38.1 C39.2 C40.1 IC5.5(GND_1) IC5.13(GND_2) R14.1 R24.1
USB2_5V: L4.1
FTVCC: C38.2 C39.1 IC5.4(VCC) L4.2
FTVOUT: C37.2 IC5.2(RESET#) IC5.3(3.3VOUT)
SEUART_RX: J8.1 ; port SE_UART_RX
SEUART_TX: J7.1 ; port SE_UART_TX
USB2_N: IC5.1(USBDM) ; port USB2_N
USB2_P: IC5.12(USBDP) ; port USB2_P
USB_ID: U1.R9(USB_IO_ID)
USB_N: U1.V7(USB_DM) ; port USB_N
USB_P: U1.W7(USB_DP) ; port USB_P
USB_REXT: R14.2 U1.V8(USB_REXT)
NetIC5_7: IC5.7(TXD) J8.2
NetIC5_10: IC5.10(RXD) J7.2
NetR22_1: R22.1 R23.2
NetR23_1: R23.1 R24.2 U1.W6(USB_VBUS)

Not connected (* = marked no-connect by the designer): IC5 6(CBUS0)* 8(RTS#)* 11(CTS#)*; U1 V9(MIPIDSI_1_N)* V10(MIPIDSI_C_N)* V11(MIPIDSI_0_N)* V13(MIPI_REXT)* V14(MIPICSI_0_N)* V15(MIPICSI_1_N)* V16(MIPICSI_C_N)* W9(MIPIDSI_1_P)* W10(MIPIDSI_C_P)* W11(MIPIDSI_0_P)* W14(MIPICSI_0_P)* W15(MIPICSI_1_P)* W16(MIPICSI_C_P)*

### Layout directives
differential pair; differential pair class USB_D_: USB_N, USB_P

### Notes on the sheet
- Project:
- Sheet Name
- Project revision:
- Drawn by:
- Sheet size
- SHEET
- OF
- (in symbol E7_B0_194BGA, part D) E Series BGA MIPI & USB

### Library data of the parts
C37 C38 C40 = CMP-001-00090-1: as C17 on sheet BoardConnectors; RoHS Compliant: Yes; Case/Package: 0603; Max Operating Temperature: 125°C; Min Operating Temperature: -55°C; Capacitor Type: Ceramic; Mounting Technology: Surface Mount; Pins: 2; Value: 100nF
C39 = CMP-001-00088-4: as C6 on sheet CPUPower; Min Operating Temperature: -55°C; Max Operating Temperature: 85°C; Case/Package: 0603; RoHS Compliant: Yes; Capacitor Type: Ceramic; Mounting Technology: Surface Mount; Pins: 2
IC5 = FT234XD-T: Integrated Circuit; Manufacturer_Name: FTDI(Future Designs); Datasheet Link: https://datasheet.lcsc.com/szlcsc/1811190128_Future-Designs-FT234XD-T_C89606.pdf; Height: 0.8mm; Manufacturer_Part_Number: FT234XD-T
J7 J8 = CMP-009-00061-2: Pins: 2
L4 = CMP-2000-05196-1: Chip Bead for Power Filtering, 1500 mA, 600 Ohm, -40 to 125 degC, 0805 (2012 Metric), RoHS, Tape and Reel; Manufacturer: Laird; Filter Type: PowerLine; Current Rating (Max): 1.5A; Catalog Drawings: (HI,HZ,LI,MI)0805Series_1.10mmMax.Height; Impedance @ Frequency: 600Ohm@100MHz; Number of Lines: 1; DC Resistance (DCR) (Max): 100mOhm; Other Names: 240-2390-1; Kits: 240-2227-ND-KITEMIFERRITEBEADCHIPSMD; Online Catalog: MISeries; Standard Package: 1; Datasheet Version: Rev. A, 01/2004; Height (Max): 0.043"(1.10mm); Category: Filters; Operating Temperature: -40degC~125degC; Package Description: 2-Pin Surface Mount Device, Body 2 x 1.25 mm; Package / Case: 0805(2012Metric); Package Reference: MI0805K601R-10-2; Packaging: CutTape(CT); Ratings: -; Mounting Type: SurfaceMount; Datasheet URL: https://datasheet.ciiva.com/3082/mi0805k601r-10-a-vp-3082219.pdf; Size / Dimension: 0.079"Lx0.049"W(2.00mmx1.25mm); Family: FerriteBeadsandChips; Manufacturer URL: https://www.lairdtech.com; Series: MI
R14 = CMP-009-00178-1: Fixed Resistor, Metal Glaze/thick Film, 0.1W, 200ohm, 50V, 5% +/-Tol, 200ppm/Cel, Surface Mount, 0603; Power: 100mW; Max Operating Temperature: 155°C; Mounting Technology: Surface Mount; Pins: 2; RoHS Compliant: Yes; Case/Package: 0603; Tolerance: 5%; Min Operating Temperature: -55°C
R22-R24 = CMP-2000-00803-1: as R11 on sheet BoardConnectors
U1 = E7_B0_194BGA: as U1 on sheet CPUPower

## Sheet MCUPinout.SchDoc
size 393 x 279 mm; DrawnBy: Gustav Eckerbom; SheetNumber: 5; SheetTotal: 6; Project: alife7-genx320cam; Sheet Name: I/O; Sheet Size: A3; Project Revision: Rev1
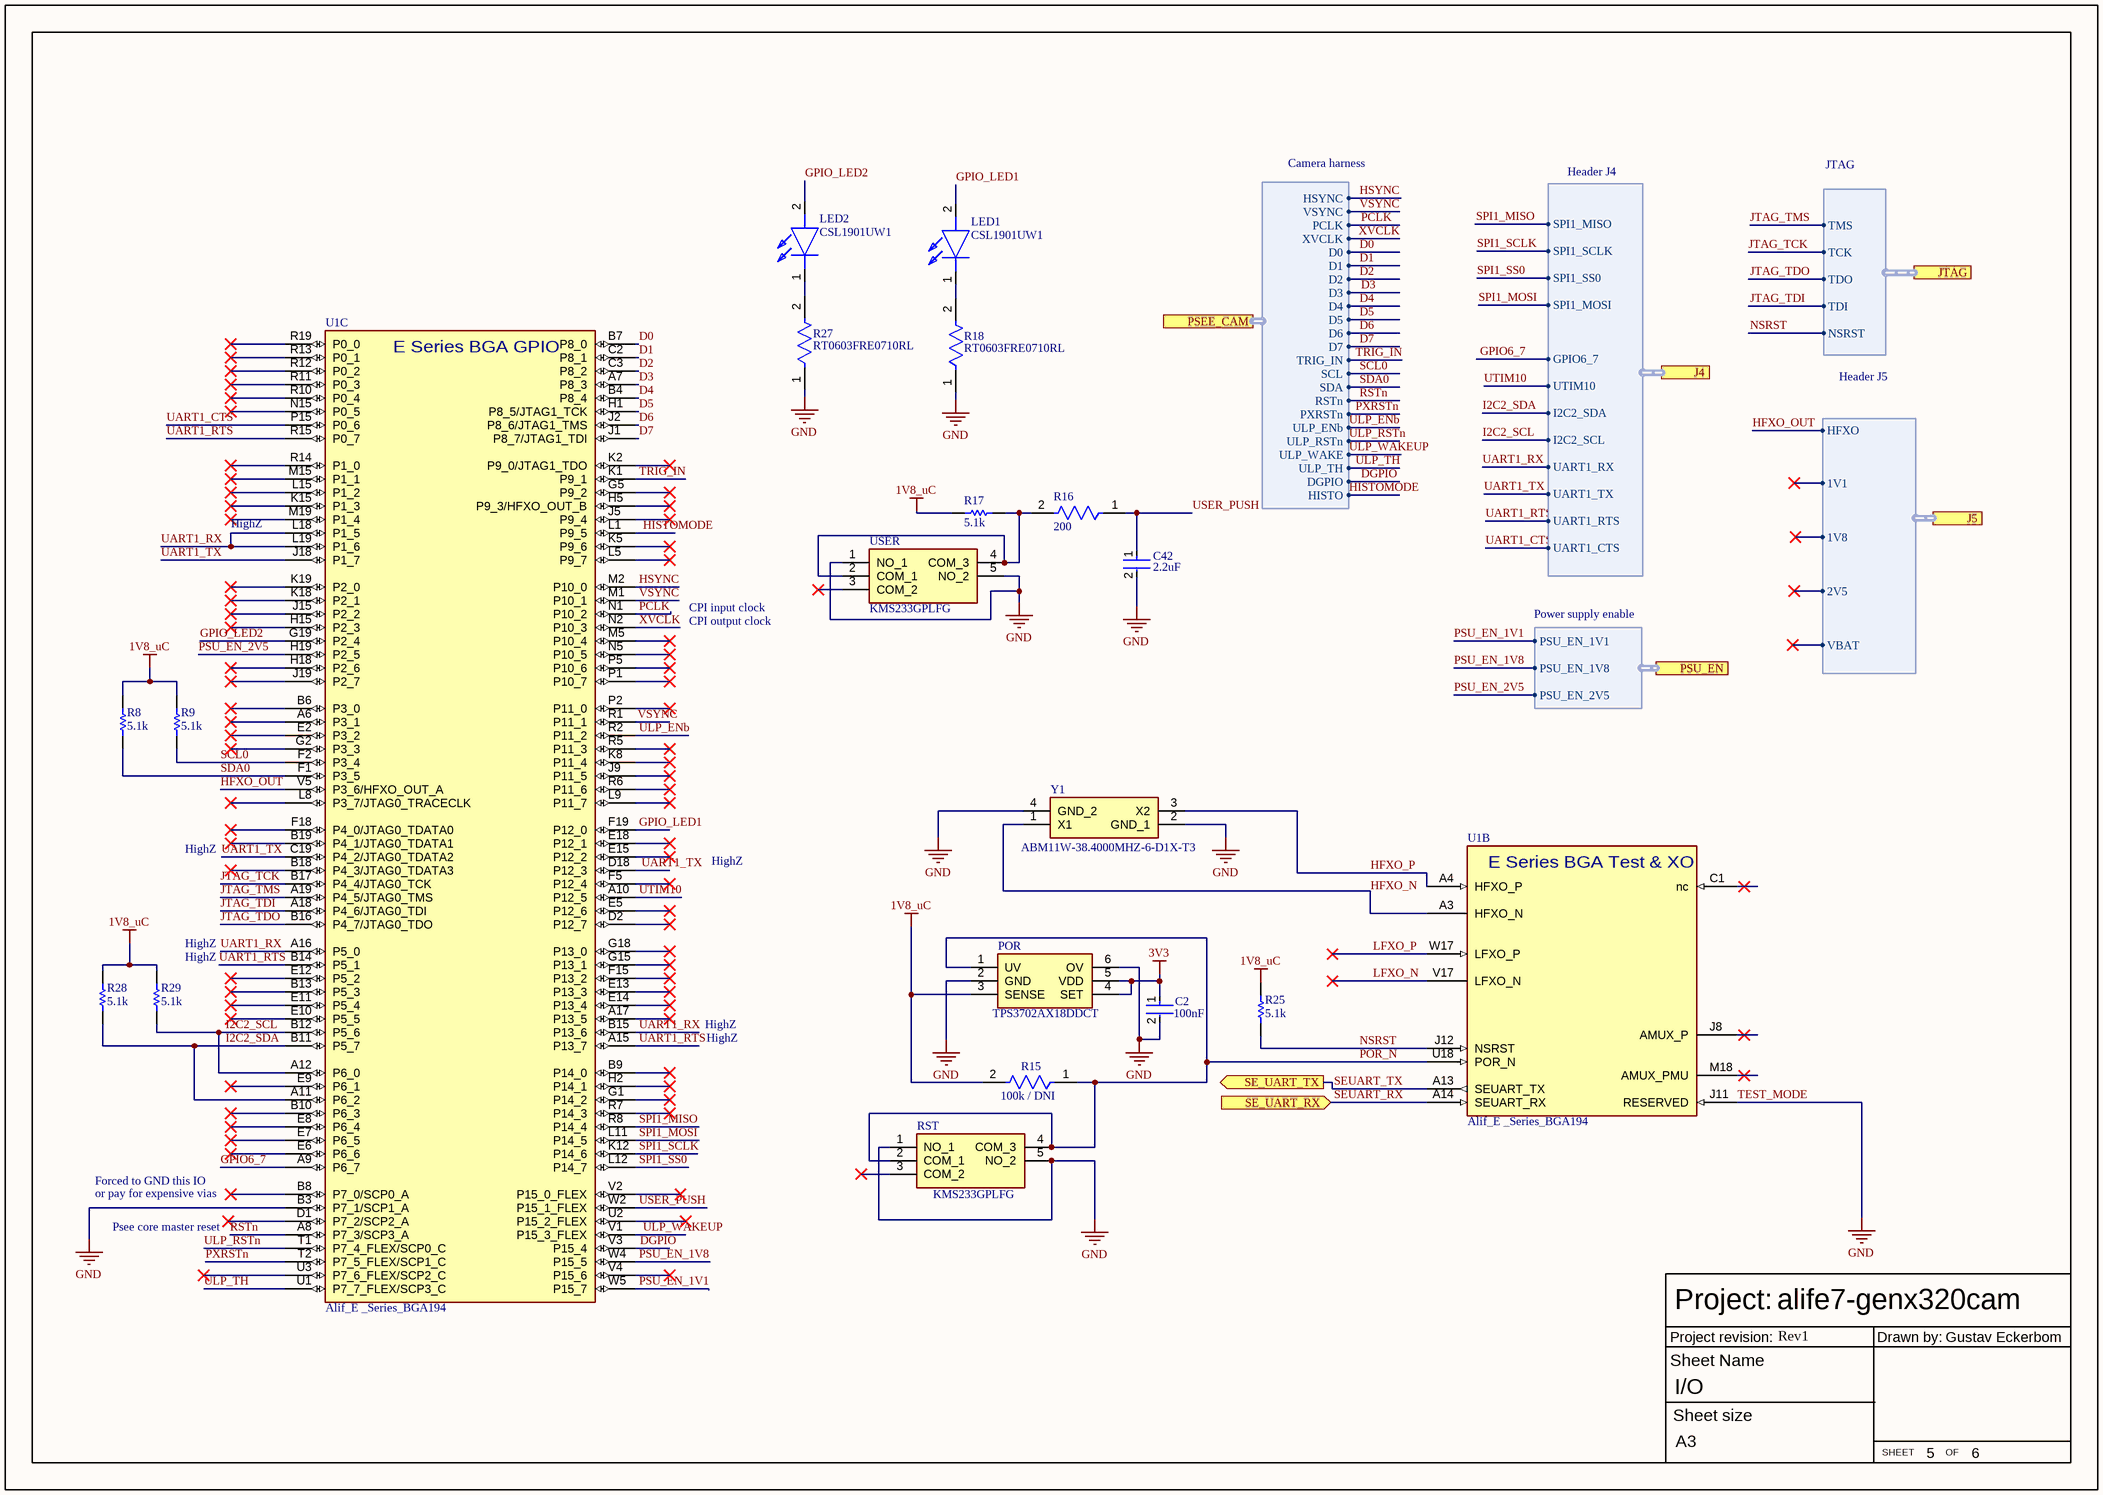
[diagram p5: MCUPinout.SchDoc]

### Parts
C2  100nF  [FP-C0603X104K3RACTU-MFG]
C42  2.2uF  [FP-CC0603-DA-MFG]
LED1  CSL1901UW1  [CSL1901UW1]
LED2  CSL1901UW1  [CSL1901UW1]
POR  TPS3702AX18DDCT  [SOT95P280X110-6N]
R8  5.1k  [RESC1608X55X30LL15T15]
R9  5.1k  [RESC1608X55X30LL15T15]
R15  100k / DNI  [FP-RC0603-0_55-IPC_B]
R16  value 200  [FP-MCR03-IPC_C]  (hidden comment: 200R)
R17  5.1k  [RESC1608X55X30LL15T15]
R18  RT0603FRE0710RL  [FP-RT0603-IPC_C]
R25  5.1k  [RESC1608X55X30LL15T15]
R27  RT0603FRE0710RL  [FP-RT0603-IPC_C]
R28  5.1k  [RESC1608X55X30LL15T15]
R29  5.1k  [RESC1608X55X30LL15T15]
RST  KMS233GPLFG  [KMS233GPLFG]
U1  Alif_E _Series_BGA194  [BGA194 _CENTERED]  (parts B,C of 4)
USER  KMS233GPLFG  [KMS233GPLFG]
Y1  ABM11W-38.4000MHZ-6-D1X-T3  [ABM11W300000MHZ4B1UT3]

### Ports
J4 (harness Header J4), J5 (harness Header J5), JTAG (harness JTAG), PSEE_CAM (harness Camera harness), PSU_EN (harness Power supply enable), SE_UART_RX (in), SE_UART_TX (out)

### Harnesses
JTAG: TMS, TCK, TDO, TDI, NSRST
Power supply enable: PSU_EN_1V1, PSU_EN_1V8, PSU_EN_2V5
Camera harness: HSYNC, VSYNC, PCLK, XVCLK, D0, D1, D2, D3, D4, D5, D6, D7, SCL, SDA, RSTn, PXRSTn, ULP_ENb, ULP_RSTn, ULP_WAKE, ULP_TH, DGPIO, HISTO, TRIG_IN
Header J5: HFXO, 1V1, 2V5, 1V8, VBAT
Header J4: SPI1_MOSI, GPIO6_7, UTIM10, I2C2_SDA, UART1_TX, UART1_RX, I2C2_SCL, SPI1_SS0, SPI1_MISO, SPI1_SCLK, UART1_RTS, UART1_CTS

### Nets
1V8_uC: POR.3(SENSE) R8.2 R9.2 R15.2 R17.2 R25.1 R28.2 R29.2
3V3: C2.1 POR.4(SET) POR.5(VDD) ; port J5.VBAT
GND: C2.2 C42.2 POR.2(GND) POR.6(OV) R18.1 R27.1 RST.1(NO_1) RST.5(NO_2) U1.B3(P7_1/SCP1_A) U1.J11(RESERVED) USER.1(NO_1) USER.5(NO_2) Y1.2(GND_1) Y1.4(GND_2)  [also labelled TEST_MODE]
D0: U1.B7(P8_0) ; port PSEE_CAM.D0
D1: U1.C2(P8_1) ; port PSEE_CAM.D1
D2: U1.C3(P8_2) ; port PSEE_CAM.D2
D3: U1.A7(P8_3) ; port PSEE_CAM.D3
D4: U1.B4(P8_4) ; port PSEE_CAM.D4
D5: U1.H1(P8_5/JTAG1_TCK) ; port PSEE_CAM.D5
D6: U1.J2(P8_6/JTAG1_TMS) ; port PSEE_CAM.D6
D7: U1.J1(P8_7/JTAG1_TDI) ; port PSEE_CAM.D7
DGPIO: U1.V3(P15_4) ; port PSEE_CAM.DGPIO
GPIO6_7: U1.A9(P6_7) ; port J4.GPIO6_7
GPIO_LED1: LED1.2(A) U1.F19(P12_0)
GPIO_LED2: LED2.2(A) U1.G19(P2_4)
HFXO_N: U1.A3(HFXO_N) Y1.1(X1)
HFXO_OUT: U1.V5(P3_6/HFXO_OUT_A) ; port J5.HFXO
HFXO_P: U1.A4(HFXO_P) Y1.3(X2)
HISTOMODE: U1.L1(P9_5) ; port PSEE_CAM.HISTO
HSYNC: U1.M2(P10_0) ; port PSEE_CAM.HSYNC
I2C2_SCL: R29.1 U1.A12(P6_0) U1.B12(P5_6) ; port J4.I2C2_SCL
I2C2_SDA: R28.1 U1.A11(P6_2) U1.B11(P5_7) ; port J4.I2C2_SDA
JTAG_TCK: U1.B17(P4_4/JTAG0_TCK) ; port JTAG.TCK
JTAG_TDI: U1.A18(P4_6/JTAG0_TDI) ; port JTAG.TDI
JTAG_TDO: U1.B16(P4_7/JTAG0_TDO) ; port JTAG.TDO
JTAG_TMS: U1.A19(P4_5/JTAG0_TMS) ; port JTAG.TMS
LFXO_N: U1.V17(LFXO_N)
LFXO_P: U1.W17(LFXO_P)
NSRST: R25.2 U1.J12(NSRST) ; port JTAG.NSRST
PCLK: U1.N1(P10_2) ; port PSEE_CAM.PCLK
POR_N: POR.1(UV) R15.1 RST.2(COM_1) RST.4(COM_3) U1.U18(POR_N)
PSU_EN_1V1: U1.W5(P15_7) ; port PSU_EN.PSU_EN_1V1
PSU_EN_1V8: U1.W4(P15_5) ; port PSU_EN.PSU_EN_1V8
PSU_EN_2V5: U1.H19(P2_5) ; port PSU_EN.PSU_EN_2V5
PXRSTn: U1.T2(P7_5_FLEX/SCP1_C) ; port PSEE_CAM.PXRSTn
RSTn: U1.A8(P7_3/SCP3_A) ; port PSEE_CAM.RSTn
SCL0: R9.1 U1.F2(P3_4) ; port PSEE_CAM.SCL
SDA0: R8.1 U1.F1(P3_5) ; port PSEE_CAM.SDA
SEUART_RX: U1.A14(SEUART_RX) ; port SE_UART_RX
SEUART_TX: U1.A13(SEUART_TX) ; port SE_UART_TX
SPI1_MISO: U1.R8(P14_4) ; port J4.SPI1_MISO
SPI1_MOSI: U1.L11(P14_5) ; port J4.SPI1_MOSI
SPI1_SCLK: U1.K12(P14_6) ; port J4.SPI1_SCLK
SPI1_SS0: U1.L12(P14_7) ; port J4.SPI1_SS0
TRIG_IN: U1.K1(P9_1) ; port PSEE_CAM.TRIG_IN
UART1_CTS: U1.P15(P0_6) ; port J4.UART1_CTS
UART1_RTS: U1.A15(P13_7) U1.B14(P5_1) U1.R15(P0_7) ; port J4.UART1_RTS
UART1_RX: U1.A16(P5_0) U1.B15(P13_6) U1.L18(P1_5) U1.L19(P1_6) ; port J4.UART1_RX
UART1_TX: U1.C19(P4_2/JTAG0_TDATA2) U1.D18(P12_3) U1.J18(P1_7) ; port J4.UART1_TX
ULP_ENb: U1.R2(P11_2) ; port PSEE_CAM.ULP_ENb
ULP_RSTn: U1.T1(P7_4_FLEX/SCP0_C) ; port PSEE_CAM.ULP_RSTn
ULP_TH: U1.U1(P7_7_FLEX/SCP3_C) ; port PSEE_CAM.ULP_TH
ULP_WAKEUP: U1.V1(P15_3_FLEX) ; port PSEE_CAM.ULP_WAKE
USER_PUSH: C42.1 R16.1 U1.W2(P15_1_FLEX)
UTIM10: U1.A10(P12_5) ; port J4.UTIM10
VSYNC: U1.M1(P10_1) U1.R1(P11_1) ; port PSEE_CAM.VSYNC
XVCLK: U1.N2(P10_3) ; port PSEE_CAM.XVCLK
NetLED1_1: LED1.1(K) R18.2
NetLED2_1: LED2.1(K) R27.2
NetR16_2: R16.2 R17.1 USER.2(COM_1) USER.4(COM_3)

Not connected (* = marked no-connect by the designer): RST 3(COM_2)*; U1 A6(P3_1)* A17(P13_5)* B6(P3_0)* B8(P7_0/SCP0_A)* B9(P14_0)* B10(P6_3)* B13(P5_3)* B18(P4_3/JTAG0_TDATA3)* B19(P4_1/JTAG0_TDATA1)* C1(nc)* D1(P7_2/SCP2_A)* D2(P12_7)* E2(P3_2)* E5(P12_6)* E6(P6_6)* E7(P6_5)* E8(P6_4)* E9(P6_1)* E10(P5_5)* E11(P5_4)* E12(P5_2)* E13(P13_3)* E14(P13_4)* E15(P12_2)* E18(P12_1)* F5(P12_4)* F15(P13_2)* F18(P4_0/JTAG0_TDATA0)* G1(P14_2)* G2(P3_3)* G5(P9_2)* G15(P13_1)* G18(P13_0)* H2(P14_1)* H5(P9_3/HFXO_OUT_B)* H15(P2_3)* H18(P2_6)* J5(P9_4)* J8(AMUX_P)* J9(P11_5)* J15(P2_2)* J19(P2_7)* K2(P9_0/JTAG1_TDO)* K5(P9_6)* K8(P11_4)* K15(P1_3)* K18(P2_1)* K19(P2_0)* L5(P9_7)* L8(P3_7/JTAG0_TRACECLK)* L9(P11_7)* L15(P1_2)* M5(P10_4)* M15(P1_1)* M18(AMUX_PMU)* M19(P1_4)* N5(P10_5)* N15(P0_5)* P1(P10_7)* P2(P11_0)* P5(P10_6)* R5(P11_3)* R6(P11_6)* R7(P14_3)* R10(P0_4)* R11(P0_3)* R12(P0_2)* R13(P0_1)* R14(P1_0)* R19(P0_0)* U2(P15_2_FLEX)* U3(P7_6_FLEX/SCP2_C)* V2(P15_0_FLEX)* V4(P15_6)*; USER 3(COM_2)*

### Notes on the sheet
- HighZ
- CPI input clock
- CPI output clock
- (near R29) HighZ
- Forced to GND this IO
- or pay for expensive vias
- Psee core master reset
- Project:
- Sheet Name
- Project revision:
- Drawn by:
- Sheet size
- SHEET
- OF
- (in symbol E7_B0_194BGA, part B) E Series BGA Test & XO
- (in symbol E7_B0_194BGA, part C) E Series BGA GPIO

### Library data of the parts
C2 = CMP-2006-00002-2: as C1 on sheet CPUPower; Features: Soft Termination; Construction: Flat; Number of Pins: 2; Depth: 0.8mm; Case Code (Metric): 1608; Termination: SMD/SMT; REACH SVHC: No SVHC; Dielectric: X7R; Thickness: 0.034inch; Series: C0603X; Case Code (Imperial): 0603; Voltage: 25V; Radiation Hardening: No; Length: 1.6mm; RoHS Compliant: Yes; Case/Package: 0603; Voltage Rating (DC): 25V; Max Operating Temperature: 125°C; Package Quantity: 1; Packaging: Tape and Reel; Width: 0.8mm; Height: 0.8mm; Capacitance: 100nF; Mount: Surface Mount; Voltage Rating: 25V; Contact Plating: Tin; Min Operating Temperature: -55°C
C42 = CMP-03422-000262-1: as C3 on sheet CPUPower; Automotive: No; Temperature: -55°C to +125°C; Device Class L3: Ceramic Capacitors; Voltage Rating: 6.3 V; Device Class L1: Passive Components; Height: 0.9mm; Device Class L2: Capacitors; Temperature Range High: +125°C; Temperature Range Low: -55°C; Footprint Url: http://www.yageo.com/exep/pages/download/literatures/UPY-C_GEN_24.pdf; RoHS: TRUE; Voltage: 6.3 V; Digikey Description: CAP CER 2.2UF 6.3V X5R 0603; Package: CC0603-DA; ComponentLink2Description: Datasheet; Category: Cap; Temperature Characteristic: X5R; Capacitance: 2.2 uF; Value: 2.2 uF; Lead Free: Yes; ComponentLink2URL: http://www.yageo.com/documents/recent/UPY-GPHC_X7R_6.3V-to-50V_18.pdf; Octopart: https://octopart.com/cc0603krx5r5bb225-yageo-42244630; Mouser Description: Multilayer Ceramic Capacitors MLCC - SMD/SMT 2.2uF 6.3V X5R 10%
LED1 LED2 = CSL1901UW1: LED; Manufacturer_Name: ROHM Semiconductor; Datasheet Link: https://www.mouser.kr/datasheet/2/348/csl1901uw1_e-3006038.pdf; Height: 0.65mm; Manufacturer_Part_Number: CSL1901UW1; Mouser Part Number: 755-CSL1901UW1; Mouser Price/Stock: https://www.mouser.co.uk/ProductDetail/ROHM-Semiconductor/CSL1901UW1?qs=vvQtp7zwQdNEDNe2oY5WlQ%3D%3D
POR = TPS3702AX18DDCT: Integrated Circuit; Manufacturer_Name: Texas Instruments; Datasheet Link: http://www.ti.com/lit/gpn/TPS3702; Height: 1.1mm; Manufacturer_Part_Number: TPS3702AX18DDCT; Mouser Part Number: 595-TPS3702AX18DDCT; Mouser Price/Stock: https://www.mouser.co.uk/ProductDetail/Texas-Instruments/TPS3702AX18DDCT?qs=1CfNGUMoiQ%252B2NkXgdoj7UQ%3D%3D; Arrow Part Number: TPS3702AX18DDCT; Arrow Price/Stock: https://www.arrow.com/en/products/tps3702ax18ddct/texas-instruments
R8 R9 R17 R25 R28 R29 = CMP-2000-00803-1: as R11 on sheet BoardConnectors
R15 = CMP-03412-037829-1: as R5 on sheet BoardConnectors; Resistance Tolerance: 1%; Case Code (Metric): 1608; RoHS Compliant: Yes; Case/Package: 0603; Resistor Type: Thick Film; Length: 1.6mm; Depth: 0.8mm; Max Operating Temperature: 155°C; Tolerance: 1%; Series: RC; Contact Plating: Tin; Width: 0.8mm; Case Code (Imperial): 0603; Number of Pins: 2; Construction: Rectangular; Termination: SMD/SMT; Military Standard: Not; Voltage Rating: 50V; Height: 0.45mm; Packaging: Tape and Reel; Min Operating Temperature: -55°C
R16 = CMP-009-00178-1: as R14 on sheet MCUHighSpeed; Max Operating Temperature: 155°C; Mounting Technology: Surface Mount; Pins: 2; RoHS Compliant: Yes; Case/Package: 0603; Tolerance: 5%; Min Operating Temperature: -55°C
R18 R27 = CMP-03412-033408-1: RES SMD 10 OHM 1% 1/10W 0603; Manufacturer: Yageo; Voltage Rating: 75V; Power Rating: 0.1W; Temperature Coefficient: 50 ppm/°C; Resistance: 10Ω; Tolerance: 0.01; Value: 10Ω; Footprint Url: http://www.yageo.com/exep/pages/download/literatures/PYu-R_Mount_10.pdf; Ipc Land Pattern Name: RESC16080X45; RoHS: TRUE; Device Class L2: Resistors; Device Class L3: Chip SMD Resistors; Category: Res; Device Class L1: Passive Components; Manufacturer Part Number: RT0603FRE0710RL; ComponentLink2URL: http://www.yageo.com/documents/recent/PYu-RT_1-to-0.01_RoHS_L_9.pdf; Temperature Range Low: -55°C; Height: 0.55mm; Digikey Description: RES SMD 10 OHM 1% 1/10W 0603; Temperature Range High: +155°C; Lead Free: Yes; Composition: Thin Film; Mouser Description: Thin Film Resistors - SMD 1/10W 10 ohm 1% 50ppm; Automotive: No; Package: RT0603; Temperature: -55°C to +155°C; Series: RT; ComponentLink2Description: Datasheet; Octopart: https://octopart.com/rt0603fre0710rl-yageo-39827693
RST USER = KMS233GPLFG: Switch; Manufacturer_Name: C & K COMPONENTS; Datasheet Link: https://www.mouser.com/datasheet/2/240/kms-3050656.pdf; Height: 2mm; Manufacturer_Part_Number: KMS233GPLFG; Mouser Part Number: 611-KMS233GPLFG; Mouser Price/Stock: https://www.mouser.co.uk/ProductDetail/CK/KMS233GPLFG?qs=vOd3edNlRKCgZuExbRx79g%3D%3D; Arrow Part Number: KMS233GPLFG; Arrow Price/Stock: https://www.arrow.com/en/products/kms233gplfg/ck
U1 = E7_B0_194BGA: as U1 on sheet CPUPower
Y1 = ABM11W-38.4000MHZ-6-D1X-T3: Crystal or Oscillator; Manufacturer_Name: ABRACON; Datasheet Link: https://abracon.com/Resonators/ABM11W.pdf; Height: 0.5mm; Manufacturer_Part_Number: ABM11W-38.4000MHZ-6-D1X-T3; Mouser Part Number: 815-11W38.4-6D1XT; Mouser Price/Stock: https://www.mouser.co.uk/ProductDetail/ABRACON/ABM11W-38.4000MHZ-6-D1X-T3?qs=5aG0NVq1C4xw6l221qWTrQ%3D%3D

## Nets that join several sheets
1V1: PowerInput (1V1.1), BoardConnectors (J1.1)
1V8: PowerInput (1V8.1), BoardConnectors (J1.3)
1V8_uC: CPUPower (8 pins), PowerInput (1V8_uC.1), BoardConnectors (C17.1 J3.1 JTAG.1), MCUPinout (8 pins)
2V5: PowerInput (2V5.1), BoardConnectors (J1.5 R5.2 R6.2 R7.2)
3V3: CPUPower (8 pins), PowerInput (5 pins), BoardConnectors (J2.1 J5.10), MCUPinout (C2.1 POR.4 POR.5)
5V: PowerInput (C30.1 IC1.1 R10.2), BoardConnectors (D1.1 D2.1 D3.1), MCUHighSpeed (R22.2)
FTVIO: PowerInput (IC6.1), MCUHighSpeed (C40.2 IC5.9)
GND: CPUPower (35 pins), PowerInput (19 pins), BoardConnectors (45 pins), MCUHighSpeed (8 pins), MCUPinout (14 pins)
USB2_5V: PowerInput (IC6.4 IC6.6), BoardConnectors (D2.2 IC4.5 USB_PROG.A4_B9 USB_PROG.B4_A9), MCUHighSpeed (L4.1)
1V1_2PROBE: PowerInput (1V1.2 C27.1 L2.2 U2.4), BoardConnectors (J5.4)
1V8_2PROBE: PowerInput (1V8.2 C29.1 L3.2 U2.1), BoardConnectors (J5.6)
2V5_2probe: PowerInput (2V5.2 C34.1 U3.5), BoardConnectors (J5.8)
D0: BoardConnectors (J1.25), MCUPinout (U1.B7)
D1: BoardConnectors (J1.27), MCUPinout (U1.C2)
D2: BoardConnectors (J1.29), MCUPinout (U1.C3)
D3: BoardConnectors (J1.31), MCUPinout (U1.A7)
D4: BoardConnectors (J1.33), MCUPinout (U1.B4)
D5: BoardConnectors (J1.35), MCUPinout (U1.H1)
D6: BoardConnectors (J1.37), MCUPinout (U1.J2)
D7: BoardConnectors (J1.39), MCUPinout (U1.J1)
DGPIO: BoardConnectors (J1.11), MCUPinout (U1.V3)
GPIO6_7: BoardConnectors (J4.7), MCUPinout (U1.A9)
HFXO_OUT: BoardConnectors (J5.2), MCUPinout (U1.V5)
HISTOMODE: BoardConnectors (J1.26), MCUPinout (U1.L1)
HSYNC: BoardConnectors (J1.2), MCUPinout (U1.M2)
I2C2_SCL: BoardConnectors (J4.10), MCUPinout (R29.1 U1.A12 U1.B12)
I2C2_SDA: BoardConnectors (J4.9), MCUPinout (R28.1 U1.A11 U1.B11)
JTAG_TCK: BoardConnectors (JTAG.4), MCUPinout (U1.B17)
JTAG_TDI: BoardConnectors (JTAG.8), MCUPinout (U1.A18)
JTAG_TDO: BoardConnectors (JTAG.6), MCUPinout (U1.B16)
JTAG_TMS: BoardConnectors (JTAG.2), MCUPinout (U1.A19)
NSRST: BoardConnectors (JTAG.10), MCUPinout (R25.2 U1.J12)
PCLK: BoardConnectors (J1.6), MCUPinout (U1.N1)
PSU_EN_1V1: PowerInput (U2.7), MCUPinout (U1.W5)
PSU_EN_1V8: PowerInput (U2.9), MCUPinout (U1.W4)
PSU_EN_2V5: PowerInput (U3.3), MCUPinout (U1.H19)
PXRSTn: BoardConnectors (J1.21), MCUPinout (U1.T2)
RSTn: BoardConnectors (J1.19), MCUPinout (U1.A8)
SCL0: BoardConnectors (J1.15), MCUPinout (R9.1 U1.F2)
SDA0: BoardConnectors (J1.17), MCUPinout (R8.1 U1.F1)
SEUART_RX: MCUHighSpeed (J8.1), MCUPinout (U1.A14)
SEUART_TX: MCUHighSpeed (J7.1), MCUPinout (U1.A13)
SPI1_MISO: BoardConnectors (J4.2), MCUPinout (U1.R8)
SPI1_MOSI: BoardConnectors (J4.5), MCUPinout (U1.L11)
SPI1_SCLK: BoardConnectors (J4.3), MCUPinout (U1.K12)
SPI1_SS0: BoardConnectors (J4.4), MCUPinout (U1.L12)
TRIG_IN: BoardConnectors (J1.24), MCUPinout (U1.K1)
UART1_CTS: BoardConnectors (J4.14), MCUPinout (U1.P15)
UART1_RTS: BoardConnectors (J4.13), MCUPinout (U1.A15 U1.B14 U1.R15)
UART1_RX: BoardConnectors (J4.11), MCUPinout (U1.A16 U1.B15 U1.L18 U1.L19)
UART1_TX: BoardConnectors (J4.12), MCUPinout (U1.C19 U1.D18 U1.J18)
ULP_ENb: BoardConnectors (J1.30 R5.1), MCUPinout (U1.R2)
ULP_RSTn: BoardConnectors (J1.32 R6.1), MCUPinout (U1.T1)
ULP_TH: BoardConnectors (J1.36 R7.1 R26.2), MCUPinout (U1.U1)
ULP_WAKEUP: BoardConnectors (J1.34), MCUPinout (U1.V1)
USB2_N: BoardConnectors (IC4.4), MCUHighSpeed (IC5.1)
USB2_P: BoardConnectors (IC4.6), MCUHighSpeed (IC5.12)
USB_N: BoardConnectors (IC2.6), MCUHighSpeed (U1.V7)
USB_P: BoardConnectors (IC2.4), MCUHighSpeed (U1.W7)
UTIM10: BoardConnectors (J4.8), MCUPinout (U1.A10)
VSYNC: BoardConnectors (J1.4), MCUPinout (U1.M1 U1.R1)
XVCLK: BoardConnectors (J1.13), MCUPinout (U1.N2)